# Altium project XilinxZynq7030SOM.PrjPcb (part 1 of 2)
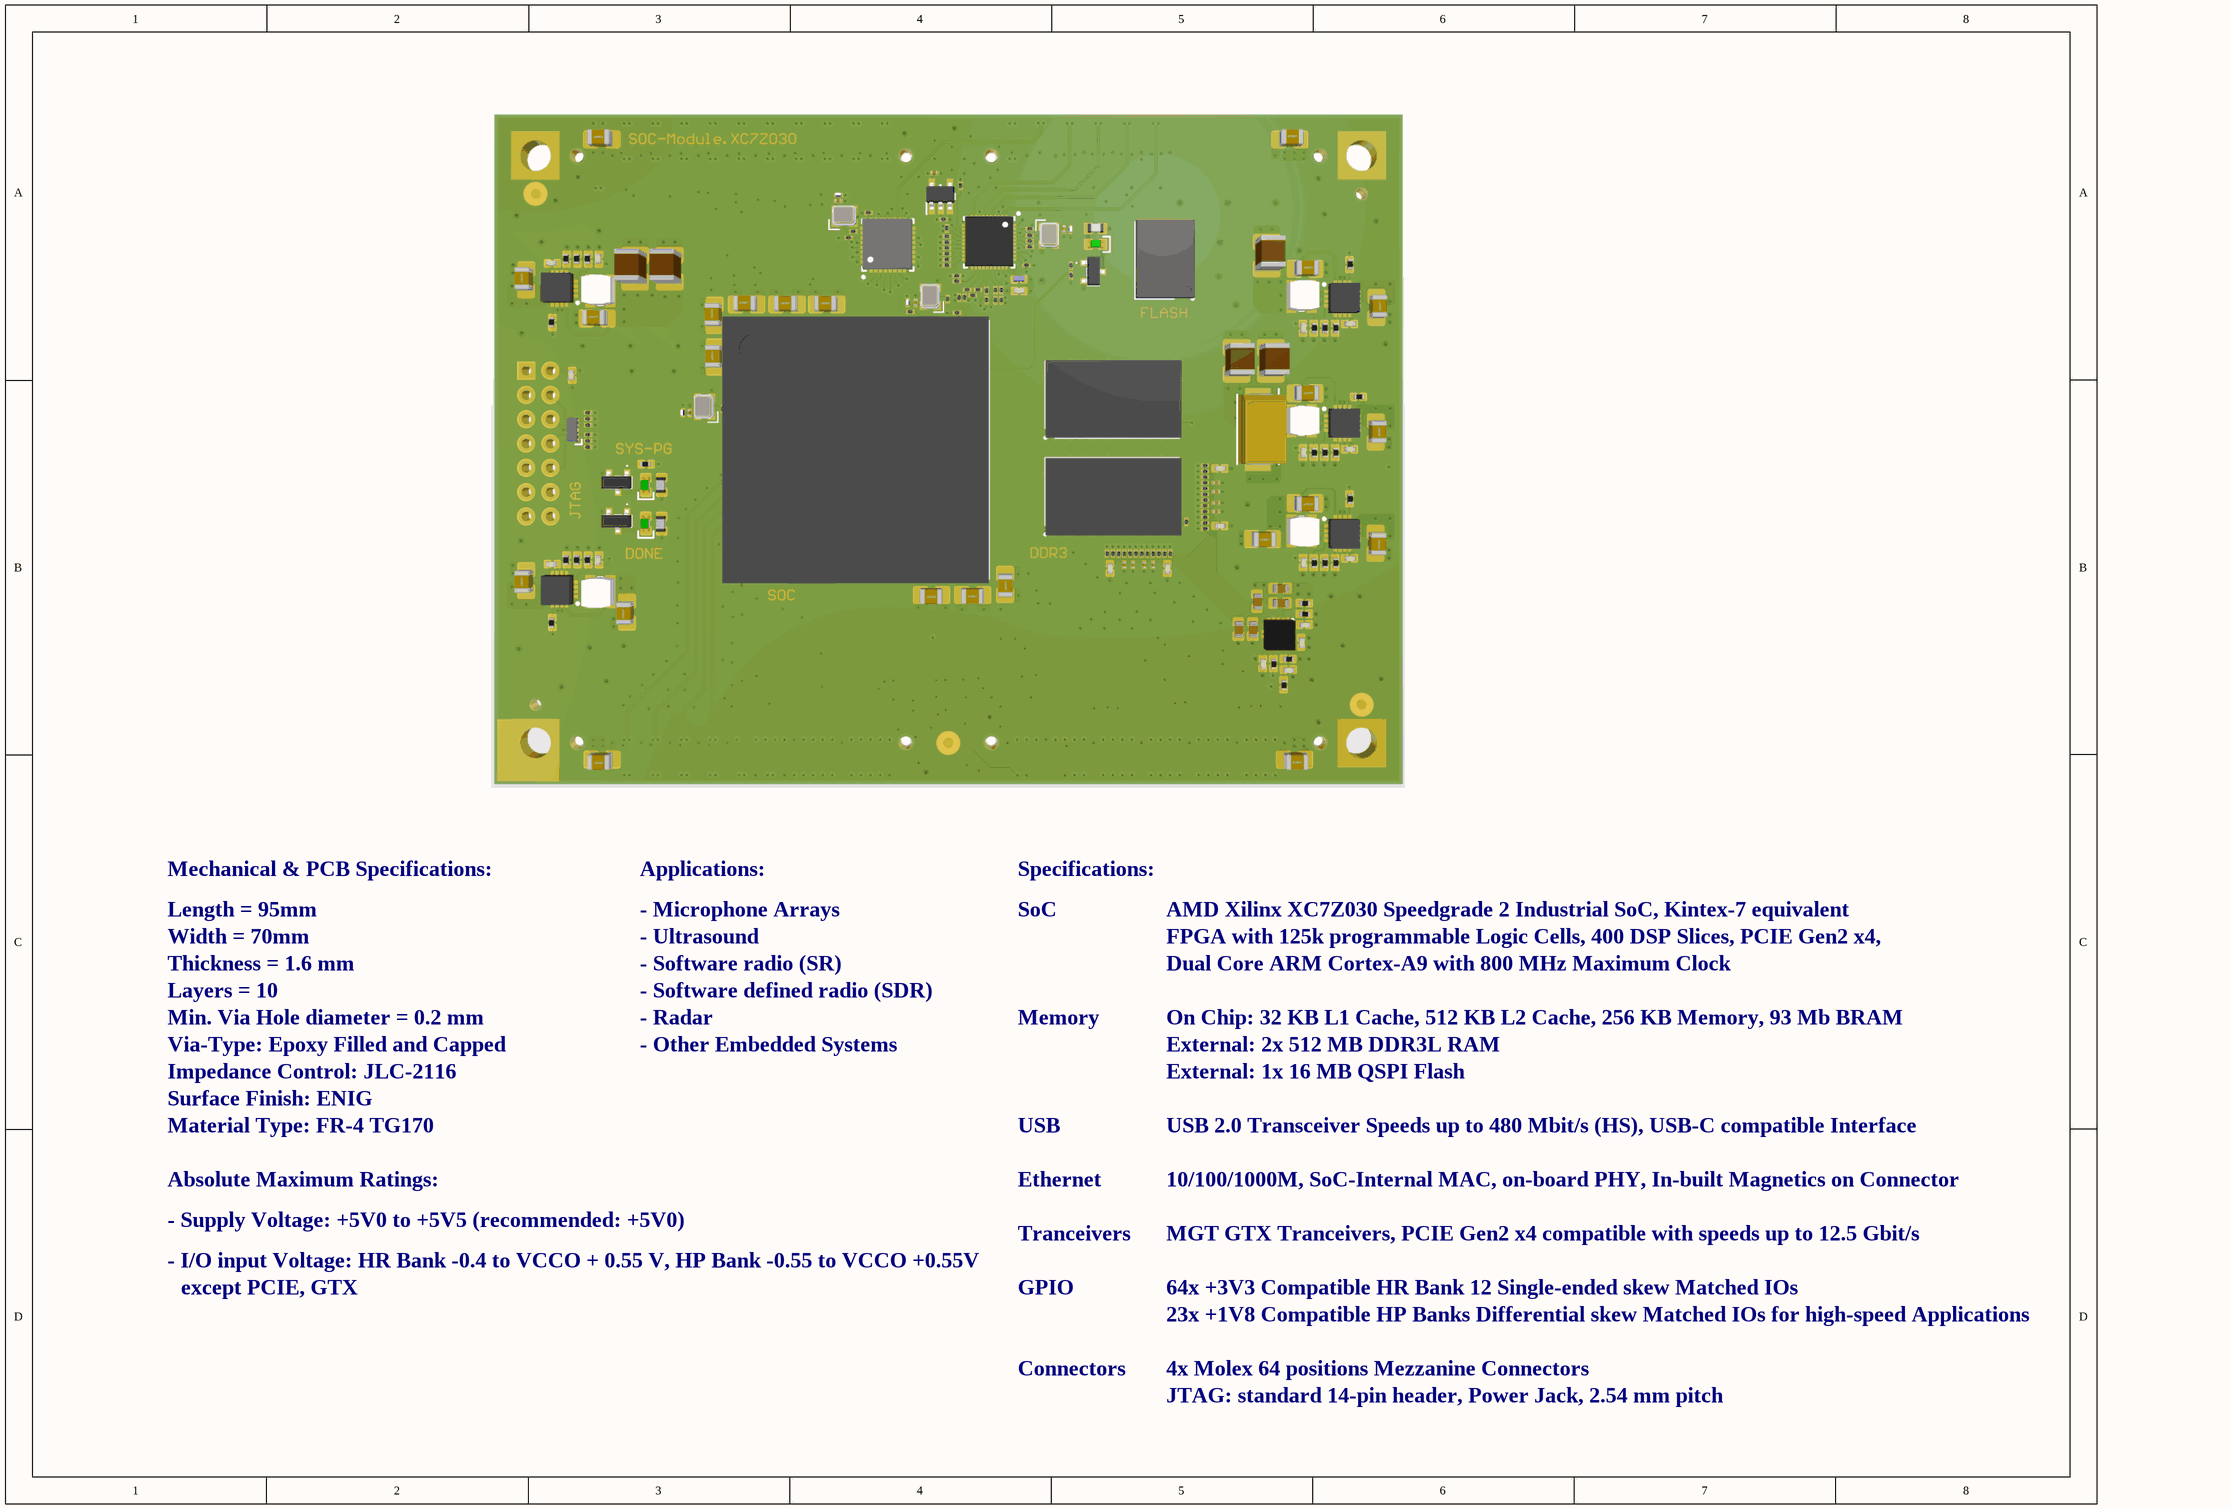
[diagram p0: SOCMainPage.SchDoc]
19 sheets, 290 parts. Net scope: global (net labels, ports and power ports of the same name join across sheets).
Board file: PCBDesign.PcbDoc
Sheets:
  SOCMainPage.SchDoc
  SOMSpecs.SchDoc
  StackupImpedanceControl.SchDoc
  SOCPDN.SchDoc
  SOCPowerSupplys.SchDoc
  SOCPowerDecoupling.SchDoc
  SOCConfiguration.SchDoc
  PLBank12.SchDoc
  PLBank13.SchDoc
  PLBank33.SchDoc
  PLBank34.SchDoc
  PLBank35.SchDoc
  PLMGTBanks.SchDoc
  SOCPSBanks.SchDoc
  SOCDDR3Bank.SchDoc
  DDR3Modules.SchDoc
  SOCEthernetPHY.SchDoc
  SOCUSBHSPHY.SchDoc
  MezzanineConnections.SchDoc

## Sheet SOCMainPage.SchDoc
size A3; SheetNumber: 1; SheetTotal: 19

### Notes on the sheet
- Length = 95mm
- Mechanical & PCB Specifications:
- Applications:
- - Microphone Arrays
- Specifications:
- SoC
- AMD Xilinx XC7Z030 Speedgrade 2 Industrial SoC, Kintex-7 equivalent
- Width = 70mm
- Thickness = 1.6 mm
- - Software radio (SR)
- - Ultrasound
- FPGA with 125k programmable Logic Cells, 400 DSP Slices, PCIE Gen2 x4,
- Dual Core ARM Cortex-A9 with 800 MHz Maximum Clock
- Layers = 10
- Via-Type: Epoxy Filled and Capped
- Min. Via Hole diameter = 0.2 mm
- - Software defined radio (SDR)
- - Radar
- - Other Embedded Systems
- Memory
- On Chip: 32 KB L1 Cache, 512 KB L2 Cache, 256 KB Memory, 93 Mb BRAM
- External: 2x 512 MB DDR3L RAM
- Impedance Control: JLC-2116
- Surface Finish: ENIG
- External: 1x 16 MB QSPI Flash
- Material Type: FR-4 TG170
- Absolute Maximum Ratings:
- USB
- Ethernet
- USB 2.0 Transceiver Speeds up to 480 Mbit/s (HS), USB-C compatible Interface
- 10/100/1000M, SoC-Internal MAC, on-board PHY, In-built Magnetics on Connector
- - Supply Voltage: +5V0 to +5V5 (recommended: +5V0)
- Tranceivers
- MGT GTX Tranceivers, PCIE Gen2 x4 compatible with speeds up to 12.5 Gbit/s
- - I/O input Voltage: HR Bank -0.4 to VCCO + 0.55 V, HP Bank -0.55 to VCCO +0.55V
- except PCIE, GTX
- GPIO
- 64x +3V3 Compatible HR Bank 12 Single-ended skew Matched IOs
- 23x +1V8 Compatible HP Banks Differential skew Matched IOs for high-speed Applications
- Connectors
- 4x Molex 64 positions Mezzanine Connectors
- JTAG: standard 14-pin header, Power Jack, 2.54 mm pitch

## Sheet SOMSpecs.SchDoc
size A4; SheetNumber: 2; SheetTotal: 19
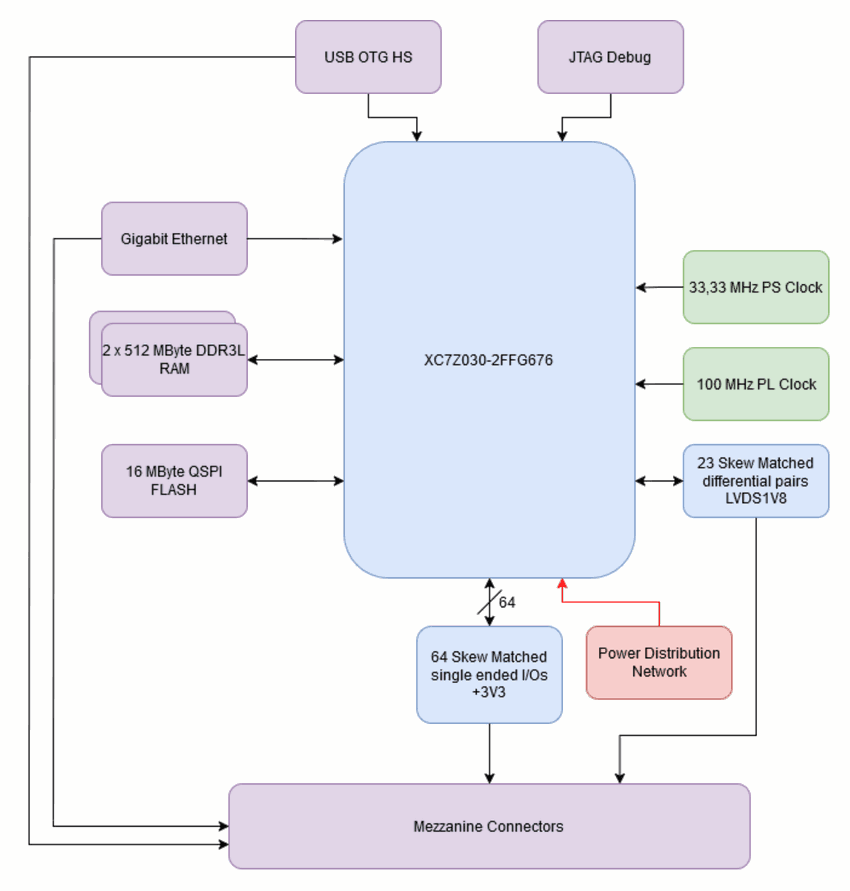
[diagram p1: SOMSpecs.SchDoc]

## Sheet StackupImpedanceControl.SchDoc
size A4; SheetNumber: 3; SheetTotal: 18
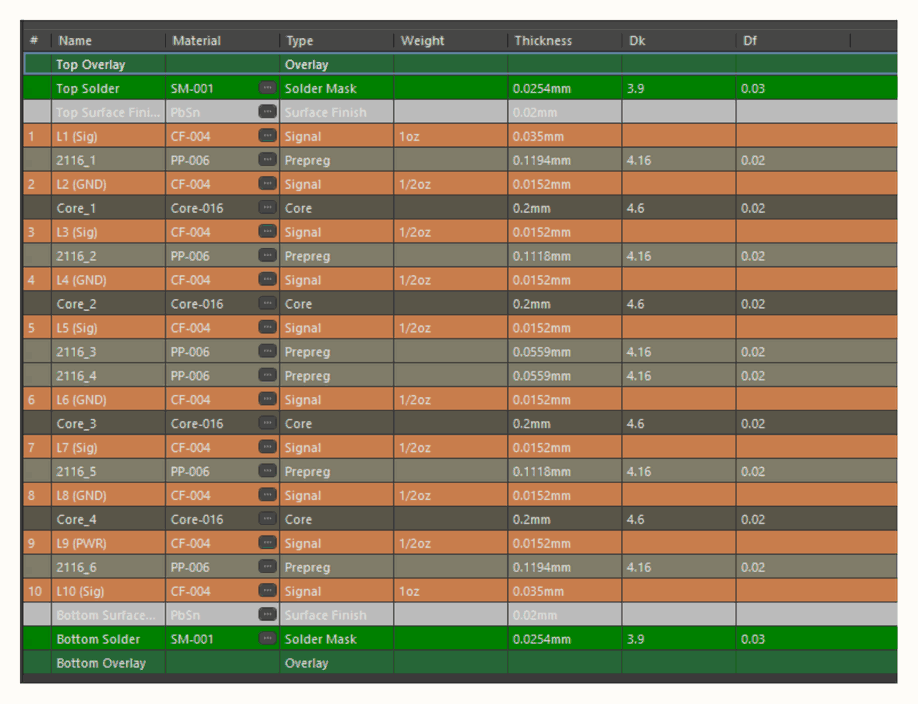
[diagram p2: StackupImpedanceControl.SchDoc]

## Sheet SOCPDN.SchDoc
size A4; SheetNumber: 4; SheetTotal: 18
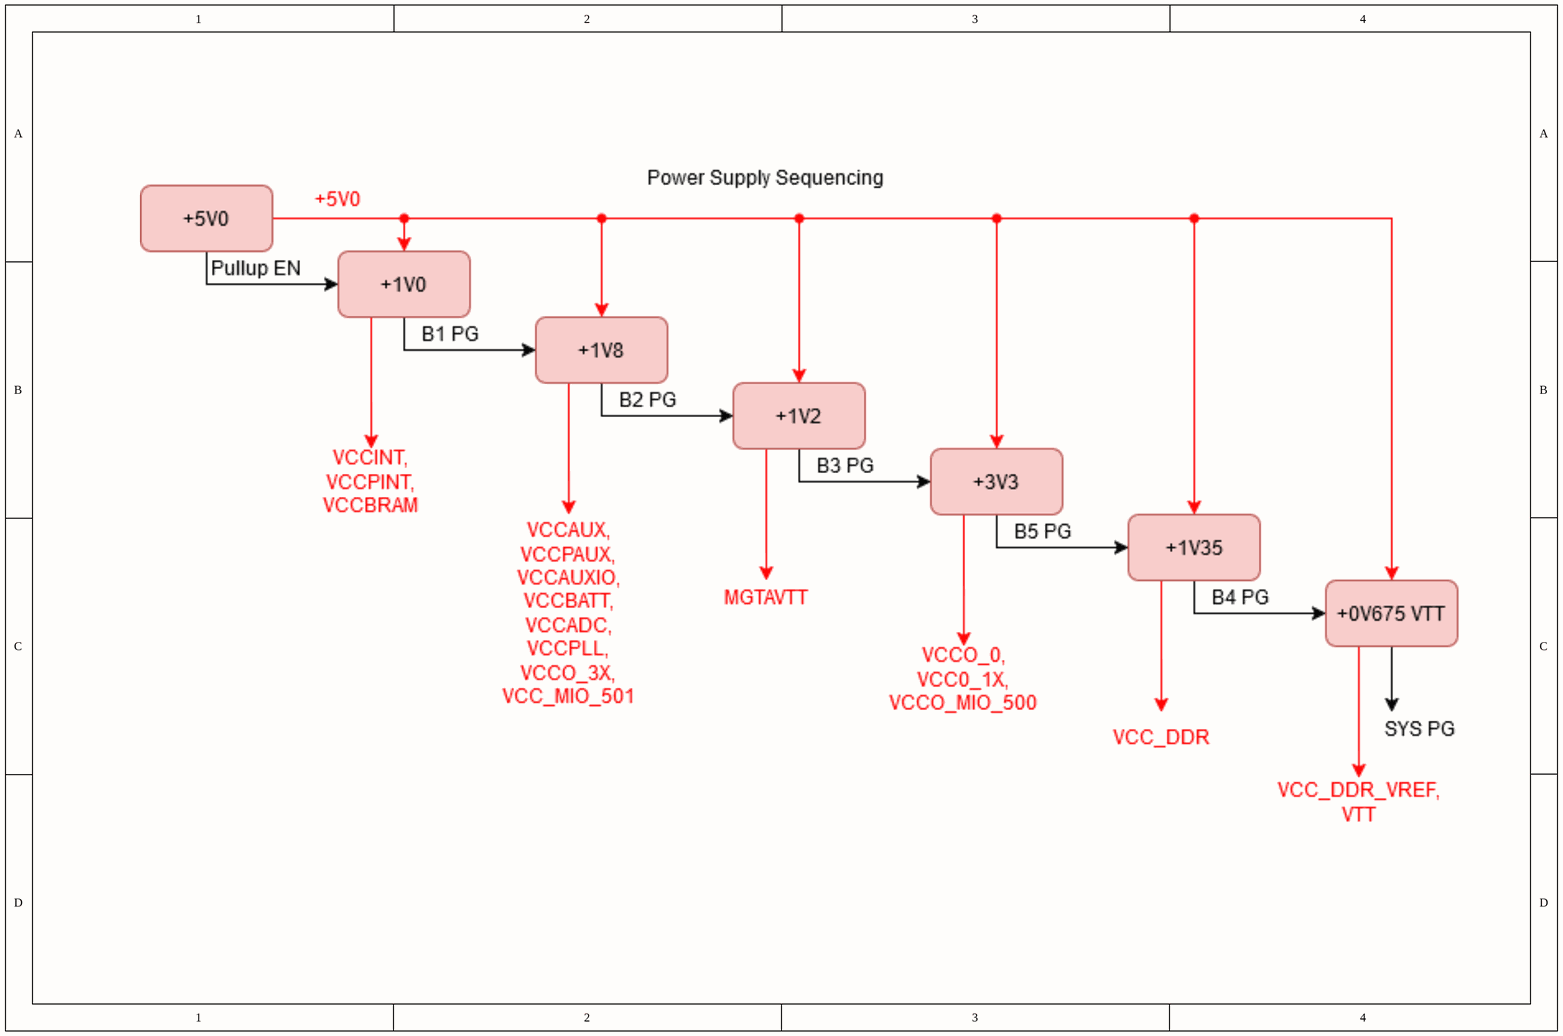
[diagram p3: SOCPDN.SchDoc]

## Sheet SOCPowerSupplys.SchDoc
size A3; SheetNumber: 5; SheetTotal: 18
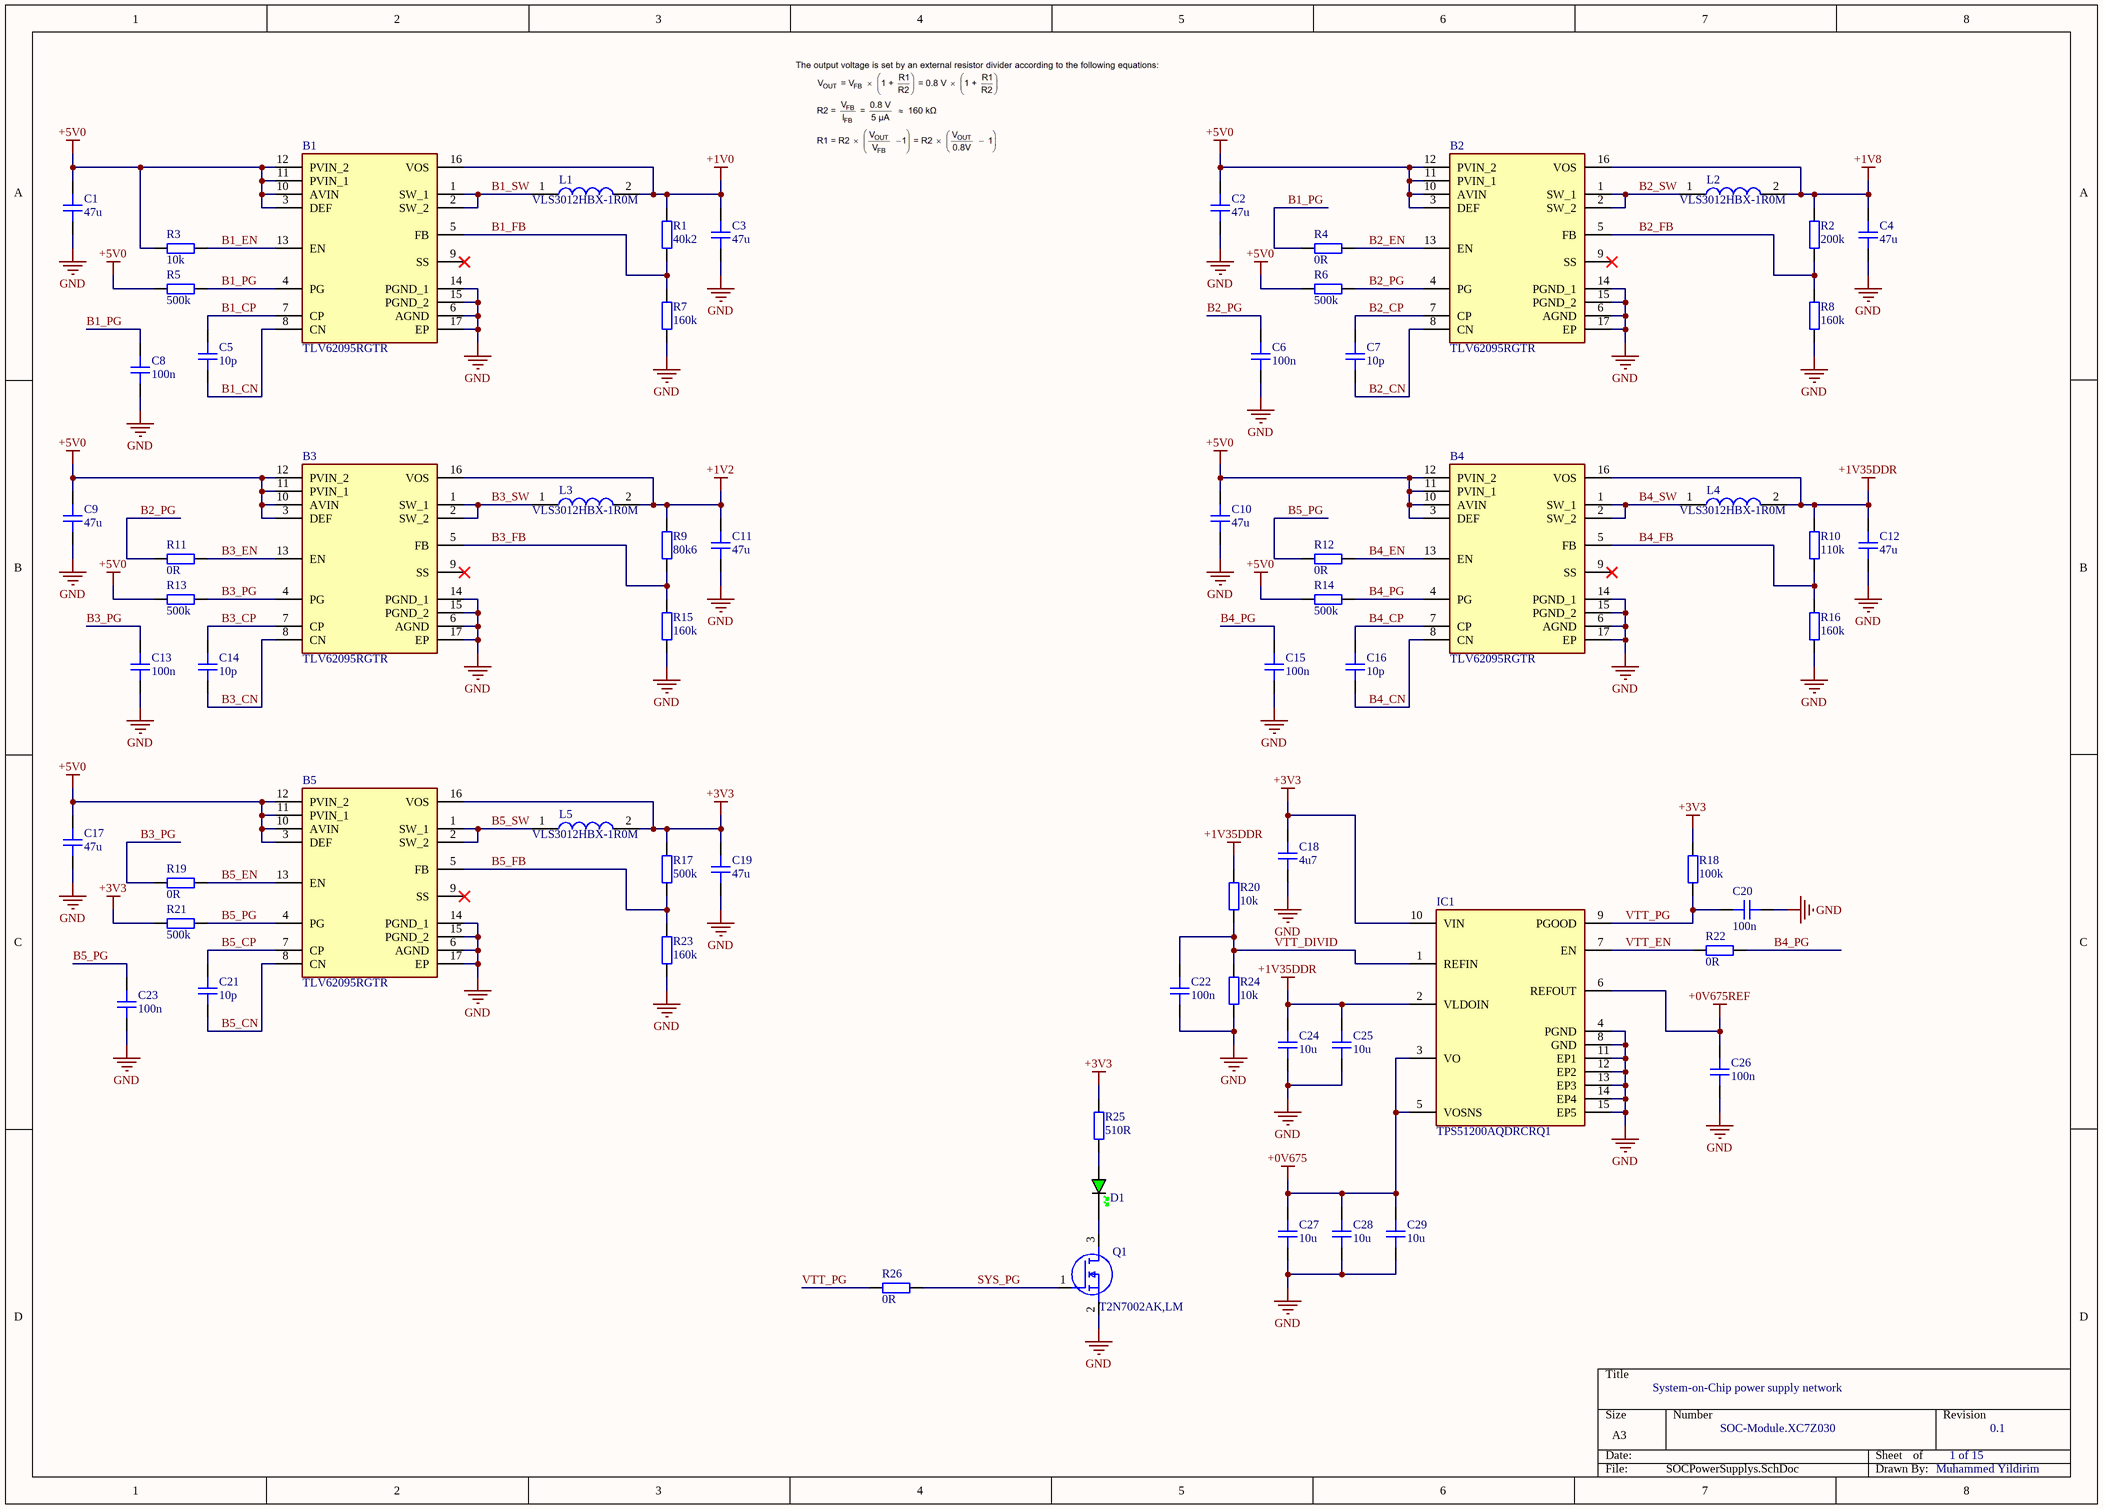
[diagram p4: SOCPowerSupplys.SchDoc]

### Parts
B1  TLV62095RGTR  [QFN50P300X300X100-17N-D]
B2  TLV62095RGTR  [QFN50P300X300X100-17N-D]
B3  TLV62095RGTR  [QFN50P300X300X100-17N-D]
B4  TLV62095RGTR  [QFN50P300X300X100-17N-D]
B5  TLV62095RGTR  [QFN50P300X300X100-17N-D]
C1  47u  [CAP_0805]
C2  47u  [CAP_0805]
C3  47u  [CAP_0805]
C4  47u  [CAP_0805]
C5  10p  [CAP_0402]
C6  100n  [CAP_0402]
C7  10p  [CAP_0402]
C8  100n  [CAP_0402]
C9  47u  [CAP_0805]
C10  47u  [CAP_0805]
C11  47u  [CAP_0805]
C12  47u  [CAP_0805]
C13  100n  [CAP_0402]
C14  10p  [CAP_0402]
C15  100n  [CAP_0402]
C16  10p  [CAP_0402]
C17  47u  [CAP_0805]
C18  4u7  [CAP_0402]
C19  47u  [CAP_0805]
C20  100n  [CAP_0402]
C21  10p  [CAP_0402]
C22  100n  [CAP_0402]
C23  100n  [CAP_0402]
C24  10u  [CAP_0603]
C25  10u  [CAP_0603]
C26  100n  [CAP_0402]
C27  10u  [CAP_0603]
C28  10u  [CAP_0603]
C29  10u  [CAP_0603]
D1  GREEN  [LED_0603_GREEN]  (value not drawn)
IC1  TPS51200AQDRCRQ1  [TPS51200AQDRCRQ1]
L1  VLS3012HBX-1R0M  [VLS3012]
L2  VLS3012HBX-1R0M  [VLS3012]
L3  VLS3012HBX-1R0M  [VLS3012]
L4  VLS3012HBX-1R0M  [VLS3012]
L5  VLS3012HBX-1R0M  [VLS3012]
Q1  T2N7002AK,LM  [TBAT54CLM]
R1  40k2  [RES_0402]
R2  200k  [RES_0402]
R3  10k  [RES_0402]
R4  0R  [RES_0402]
R5  500k  [RES_0402]
R6  500k  [RES_0402]
R7  160k  [RES_0402]
R8  160k  [RES_0402]
R9  80k6  [RES_0402]
R10  110k  [RES_0402]
R11  0R  [RES_0402]
R12  0R  [RES_0402]
R13  500k  [RES_0402]
R14  500k  [RES_0402]
R15  160k  [RES_0402]
R16  160k  [RES_0402]
R17  500k  [RES_0402]
R18  100k  [RES_0402]
R19  0R  [RES_0402]
R20  10k  [RES_0402]
R21  500k  [RES_0402]
R22  0R  [RES_0402]
R23  160k  [RES_0402]
R24  10k  [RES_0402]
R25  510R  [RES_0603]
R26  0R  [RES_0402]

### Nets
+0V675: C27.2 C28.2 C29.2 IC1.3(VO) IC1.5(VOSNS)
+0V675REF: C26.2 IC1.6(REFOUT)
+1V0: B1.16(VOS) C3.2 L1.2 R1.2
+1V2: B3.16(VOS) C11.2 L3.2 R9.2
+1V8: B2.16(VOS) C4.2 L2.2 R2.2
+1V35DDR: B4.16(VOS) C12.2 C24.2 C25.2 IC1.2(VLDOIN) L4.2 R10.2 R20.2
+3V3: B5.16(VOS) C18.2 C19.2 IC1.10(VIN) L5.2 R17.2 R18.2 R21.1 R25.2
+5V0: B1.3(DEF) B1.10(AVIN) B1.11(PVIN_1) B1.12(PVIN_2) B2.3(DEF) B2.10(AVIN) B2.11(PVIN_1) B2.12(PVIN_2) B3.3(DEF) B3.10(AVIN) B3.11(PVIN_1) B3.12(PVIN_2) B4.3(DEF) B4.10(AVIN) B4.11(PVIN_1) B4.12(PVIN_2) B5.3(DEF) B5.10(AVIN) B5.11(PVIN_1) B5.12(PVIN_2) C1.2 C2.2 C9.2 C10.2 C17.2 R3.1 R5.1 R6.1 R13.1 R14.1
GND: B1.6(AGND) B1.14(PGND_1) B1.15(PGND_2) B1.17(EP) B2.6(AGND) B2.14(PGND_1) B2.15(PGND_2) B2.17(EP) B3.6(AGND) B3.14(PGND_1) B3.15(PGND_2) B3.17(EP) B4.6(AGND) B4.14(PGND_1) B4.15(PGND_2) B4.17(EP) B5.6(AGND) B5.14(PGND_1) B5.15(PGND_2) B5.17(EP) C1.1 C2.1 C3.1 C4.1 C6.1 C8.1 C9.1 C10.1 C11.1 C12.1 C13.1 C15.1 C17.1 C18.1 C19.1 C20.1 C22.1 C23.1 C24.1 C25.1 C26.1 C27.1 C28.1 C29.1 IC1.4(PGND) IC1.8(GND) IC1.11(EP1) IC1.12(EP2) IC1.13(EP3) IC1.14(EP4) IC1.15(EP5) Q1.2(S) R7.1 R8.1 R15.1 R16.1 R23.1 R24.1
B1_CN: B1.8(CN) C5.1
B1_CP: B1.7(CP) C5.2
B1_EN: B1.13(EN) R3.2
B1_FB: B1.5(FB) R1.1 R7.2
B1_PG: B1.4(PG) C8.2 R4.2 R5.2
B1_SW: B1.1(SW_1) B1.2(SW_2) L1.1
B2_CN: B2.8(CN) C7.1
B2_CP: B2.7(CP) C7.2
B2_EN: B2.13(EN) R4.1
B2_FB: B2.5(FB) R2.1 R8.2
B2_PG: B2.4(PG) C6.2 R6.2 R11.2
B2_SW: B2.1(SW_1) B2.2(SW_2) L2.1
B3_CN: B3.8(CN) C14.1
B3_CP: B3.7(CP) C14.2
B3_EN: B3.13(EN) R11.1
B3_FB: B3.5(FB) R9.1 R15.2
B3_PG: B3.4(PG) C13.2 R13.2 R19.2
B3_SW: B3.1(SW_1) B3.2(SW_2) L3.1
B4_CN: B4.8(CN) C16.1
B4_CP: B4.7(CP) C16.2
B4_EN: B4.13(EN) R12.1
B4_FB: B4.5(FB) R10.1 R16.2
B4_PG: B4.4(PG) C15.2 R14.2 R22.1
B4_SW: B4.1(SW_1) B4.2(SW_2) L4.1
B5_CN: B5.8(CN) C21.1
B5_CP: B5.7(CP) C21.2
B5_EN: B5.13(EN) R19.1
B5_FB: B5.5(FB) R17.1 R23.2
B5_PG: B5.4(PG) C23.2 R12.2 R21.2
B5_SW: B5.1(SW_1) B5.2(SW_2) L5.1
SYS_PG: Q1.1(G) R26.1
VTT_DIVID: C22.2 IC1.1(REFIN) R20.1 R24.2
VTT_EN: IC1.7(EN) R22.2
VTT_PG: C20.2 IC1.9(PGOOD) R18.1 R26.2
NetD1_A: D1.A R25.1
NetD1_K: D1.K Q1.3(D)

Not connected (* = marked no-connect by the designer): B1 9(SS)*; B2 9(SS)*; B3 9(SS)*; B4 9(SS)*; B5 9(SS)*

### Notes on the sheet
- System-on-Chip power supply network
- SOC-Module.XC7Z030
- 1 of 15
- 0.1
- Muhammed Yildirim

### Library data of the parts
B1-B5 = TLV62095RGTR: 4A Synchronous Step Down Converter with DCS Control; Manufacturer_Name: Texas Instruments; Geometry.Height: 1mm; Mouser Part Number: 595-TLV62095RGTR; Mouser Price/Stock: https://www.mouser.co.uk/ProductDetail/Texas-Instruments/TLV62095RGTR?qs=f4l5qYp%2Fy%252B5FMQoaGbkQ%252Bg%3D%3D; Manufacturer_Part_Number: TLV62095RGTR; Datasheet Link: http://www.ti.com/lit/gpn/TLV62095
C1-C4 C9-C12 C17 C19 = CAP_0805: Capacitor SMD 0805; Manufacturer: *; Manufacturer Part Number: *; Distributor Link: *; LCSC: *; Rating: *; Dielectric: *
C5-C8 C13-C16 C18 C20-C23 C26 = CAP_0402: Capacitor SMD 0402; Manufacturer: *; Manufacturer Part Number: *; Distributor Link: *; LCSC: *; Rating: *; Dielectric: *
C24 C25 C27-C29 = CAP_0603: Capacitor SMD 0603; Manufacturer: *; Manufacturer Part Number: *; Distributor Link: *; LCSC: *; Rating: *; Dielectric: *
D1 = LED_0603_GREEN: LED 0603 GREEN SMD
IC1 = TPS51200AQDRCRQ1: Texas Instruments Sink and Source DDR Termination Regulator
L1-L5 = VLS3012HBX-1R0M: Inductor; Manufacturer_Name: TDK; Datasheet Link: https://product.tdk.com/system/files/dam/doc/product/inductor/inductor/smd/catalog/inductor_commercial_power_vls3012hbx_en.pdf; Manufacturer_Part_Number: VLS3012HBX-1R0M; Mouser Part Number: 810-VLS3012HBX-1R0M; Mouser Price/Stock: https://www.mouser.co.uk/ProductDetail/TDK/VLS3012HBX-1R0M?qs=pfd5qewlna4O71VRfcrI8g%3D%3D; Arrow Part Number: VLS3012HBX-1R0M; Arrow Price/Stock: https://www.arrow.com/en/products/vls3012hbx-1r0m/tdk?region=nac
Q1 = T2N7002AK,LM: MOSFET (N-Channel); Manufacturer_Name: Toshiba; Datasheet Link: http://toshiba.semicon-storage.com/info/docget.jsp?did=29712&prodName=T2N7002AK; Height: 1.1mm; Manufacturer_Part_Number: T2N7002AK,LM; Mouser Part Number: 757-T2N7002AKLM; Mouser Price/Stock: https://www.mouser.co.uk/ProductDetail/Toshiba/T2N7002AKLM?qs=pzVvXTvk9PzfX4hYglwZ9Q%3D%3D; Arrow Part Number: T2N7002AK,LM; Arrow Price/Stock: https://www.arrow.com/en/products/t2n7002aklm/toshiba?region=nac
R1-R24 R26 = RES_0402: Resistor SMD 0402; Manufacturer: *; Manufacturer Part Number: *; Distributor Link: *; LCSC: *
R25 = RES_0603: Resistor SMD 0603; Manufacturer: *; Manufacturer Part Number: *; Distributor Link: *; LCSC: *

## Sheet SOCPowerDecoupling.SchDoc
size A3; SheetNumber: 6; SheetTotal: 18
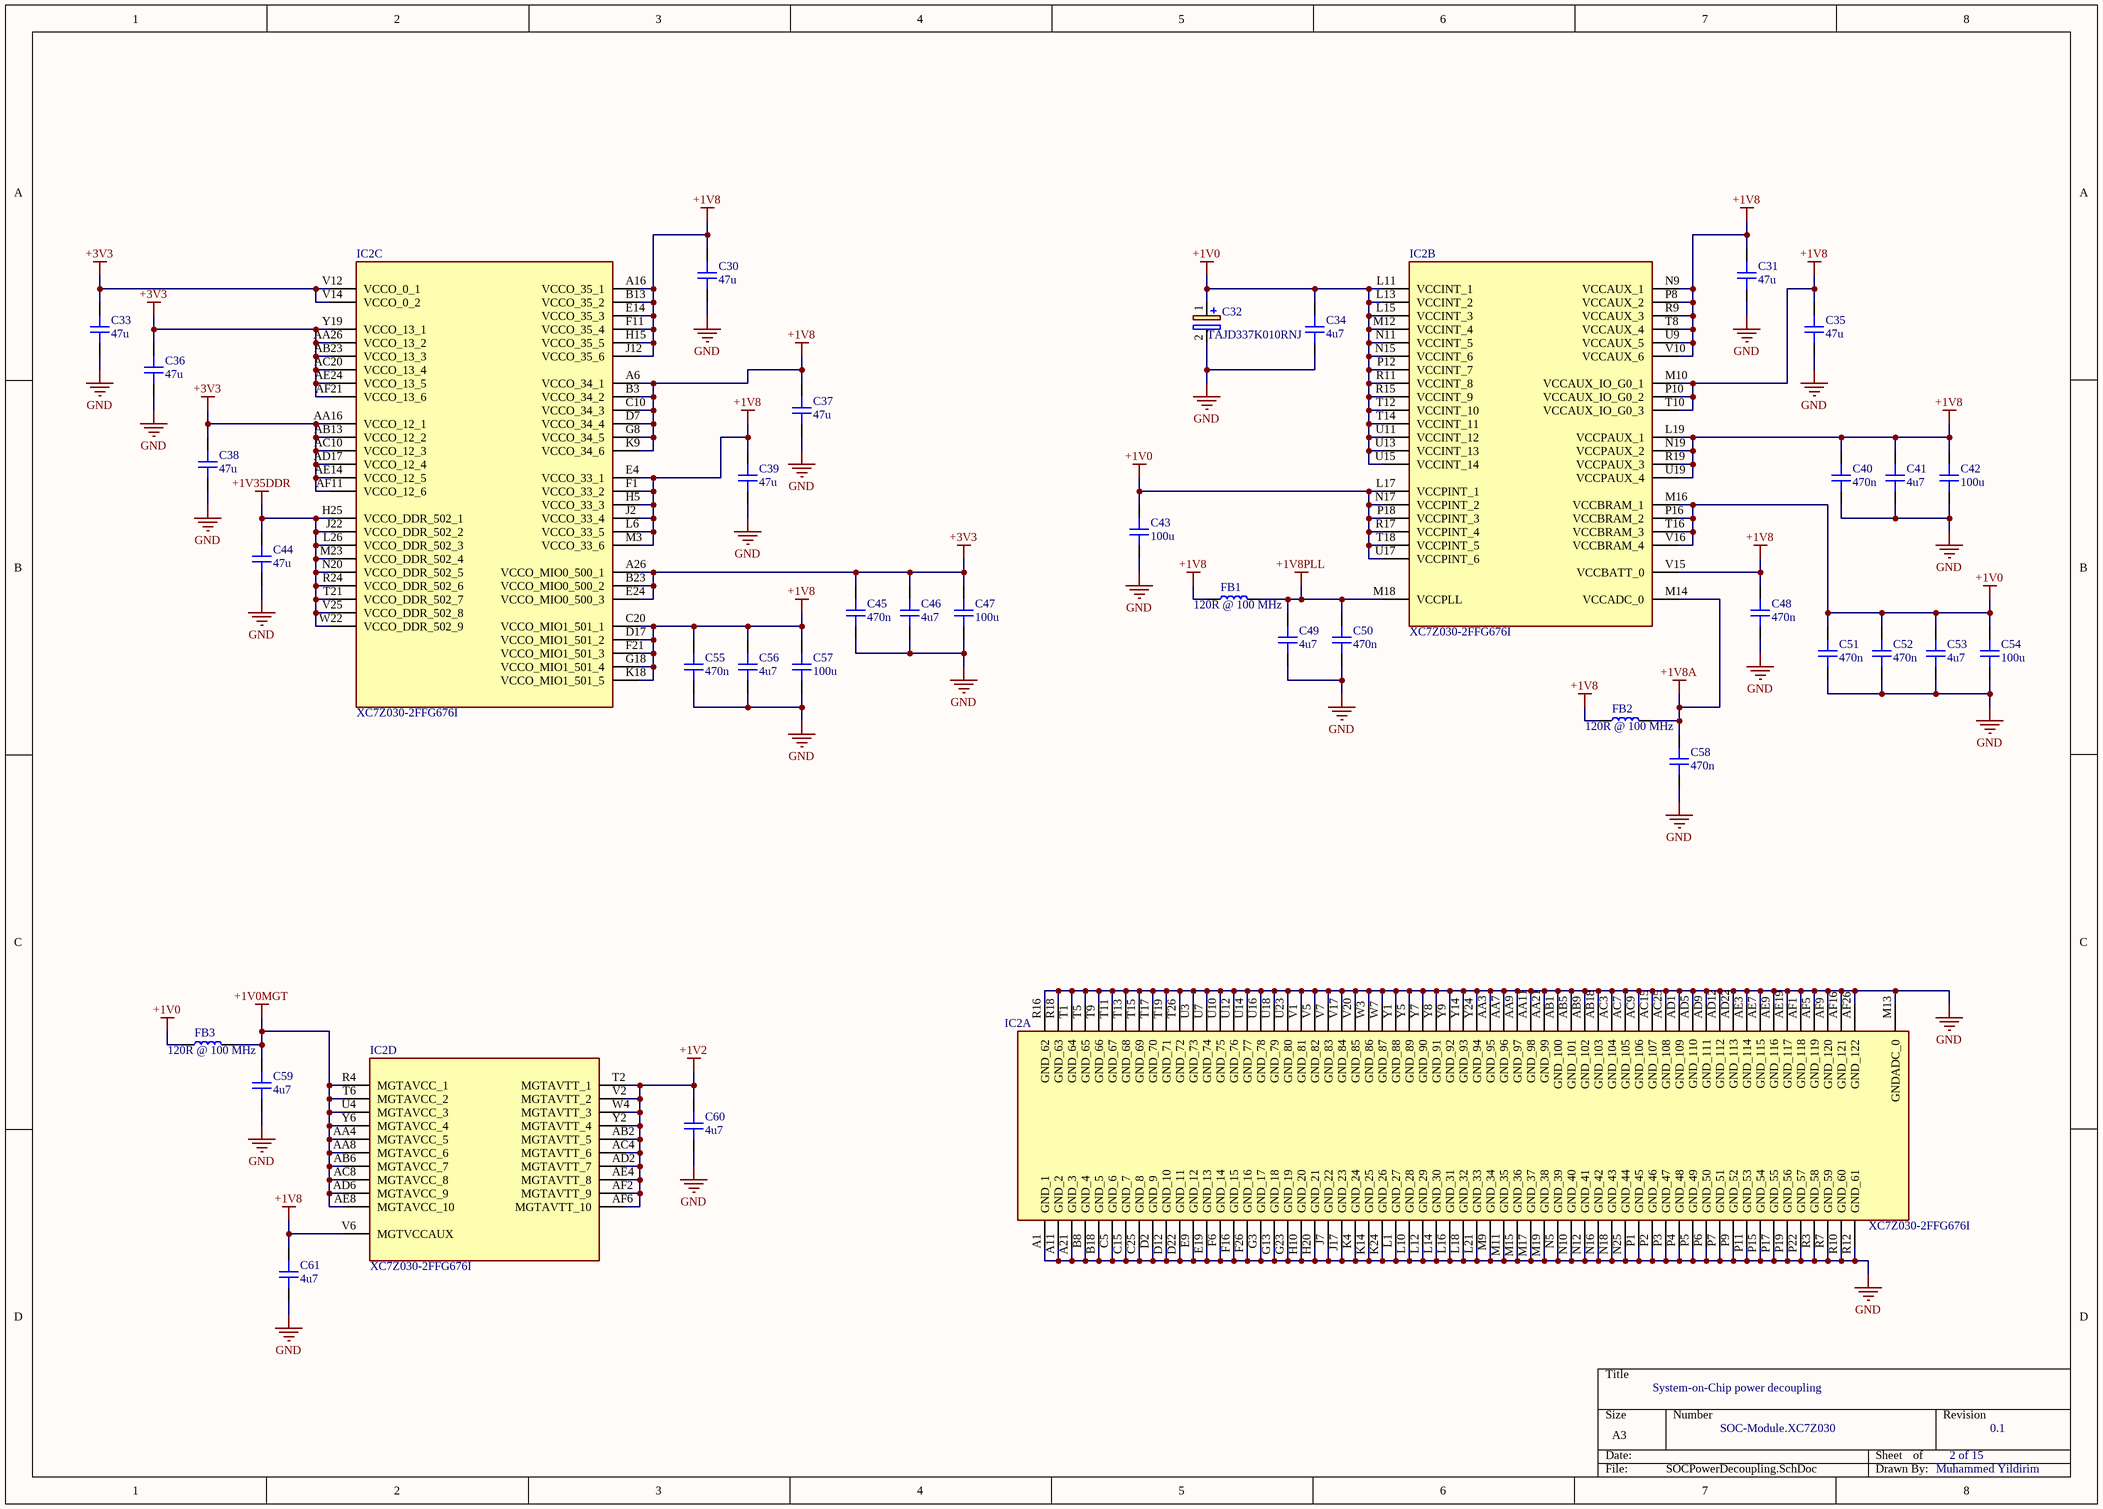
[diagram p5: SOCPowerDecoupling.SchDoc]

### Parts
C30  47u  [CAP_0805]
C31  47u  [CAP_0805]
C32  TAJD337K010RNJ  [CAPPM7344X310N]
C33  47u  [CAP_0805]
C34  4u7  [CAP_0402]
C35  47u  [CAP_0805]
C36  47u  [CAP_0805]
C37  47u  [CAP_0805]
C38  47u  [CAP_0805]
C39  47u  [CAP_0805]
C40  470n  [CAP_0201]
C41  4u7  [CAP_0402]
C42  100u  [CAP_1210]
C43  100u  [CAP_1210]
C44  47u  [CAP_0805]
C45  470n  [CAP_0201]
C46  4u7  [CAP_0402]
C47  100u  [CAP_1210]
C48  470n  [CAP_0201]
C49  4u7  [CAP_0402]
C50  470n  [CAP_0201]
C51  470n  [CAP_0201]
C52  470n  [CAP_0201]
C53  4u7  [CAP_0402]
C54  100u  [CAP_1210]
C55  470n  [CAP_0201]
C56  4u7  [CAP_0402]
C57  100u  [CAP_1210]
C58  470n  [CAP_0201]
C59  4u7  [CAP_0402]
C60  4u7  [CAP_0402]
C61  4u7  [CAP_0402]
FB1  120R @ 100 MHz  [IND_0201]
FB2  120R @ 100 MHz  [IND_0201]
FB3  120R @ 100 MHz  [IND_0201]
IC2  XC7Z030-2FFG676I  [BGA676C100P26X26_2700X2700X324]  (parts A,B,C,D of 15)

### Nets
+1V0: C32.1(+) C34.2 C43.2 C51.2 C52.2 C53.2 C54.2 FB3.1 IC2.L11(VCCINT_1) IC2.L13(VCCINT_2) IC2.L15(VCCINT_3) IC2.L17(VCCPINT_1) IC2.M12(VCCINT_4) IC2.M16(VCCBRAM_1) IC2.N11(VCCINT_5) IC2.N15(VCCINT_6) IC2.N17(VCCPINT_2) IC2.P12(VCCINT_7) IC2.P16(VCCBRAM_2) IC2.P18(VCCPINT_3) IC2.R11(VCCINT_8) IC2.R15(VCCINT_9) IC2.R17(VCCPINT_4) IC2.T12(VCCINT_10) IC2.T14(VCCINT_11) IC2.T16(VCCBRAM_3) IC2.T18(VCCPINT_5) IC2.U11(VCCINT_12) IC2.U13(VCCINT_13) IC2.U15(VCCINT_14) IC2.U17(VCCPINT_6) IC2.V16(VCCBRAM_4)
+1V0MGT: C59.2 FB3.2 IC2.AA4(MGTAVCC_5) IC2.AA8(MGTAVCC_6) IC2.AB6(MGTAVCC_7) IC2.AC8(MGTAVCC_8) IC2.AD6(MGTAVCC_9) IC2.AE8(MGTAVCC_10) IC2.R4(MGTAVCC_1) IC2.T6(MGTAVCC_2) IC2.U4(MGTAVCC_3) IC2.Y6(MGTAVCC_4)
+1V2: C60.2 IC2.AB2(MGTAVTT_5) IC2.AC4(MGTAVTT_6) IC2.AD2(MGTAVTT_7) IC2.AE4(MGTAVTT_8) IC2.AF2(MGTAVTT_9) IC2.AF6(MGTAVTT_10) IC2.T2(MGTAVTT_1) IC2.V2(MGTAVTT_2) IC2.W4(MGTAVTT_3) IC2.Y2(MGTAVTT_4)
+1V8: C30.2 C31.2 C35.2 C37.2 C39.2 C40.2 C41.2 C42.2 C48.2 C55.2 C56.2 C57.2 C61.2 FB1.1 FB2.1 IC2.A6(VCCO_34_1) IC2.A16(VCCO_35_1) IC2.B3(VCCO_34_2) IC2.B13(VCCO_35_2) IC2.C10(VCCO_34_3) IC2.C20(VCCO_MIO1_501_1) IC2.D7(VCCO_34_4) IC2.D17(VCCO_MIO1_501_2) IC2.E4(VCCO_33_1) IC2.E14(VCCO_35_3) IC2.F1(VCCO_33_2) IC2.F11(VCCO_35_4) IC2.F21(VCCO_MIO1_501_3) IC2.G8(VCCO_34_5) IC2.G18(VCCO_MIO1_501_4) IC2.H5(VCCO_33_3) IC2.H15(VCCO_35_5) IC2.J2(VCCO_33_4) IC2.J12(VCCO_35_6) IC2.K9(VCCO_34_6) IC2.K18(VCCO_MIO1_501_5) IC2.L6(VCCO_33_5) IC2.L19(VCCPAUX_1) IC2.M3(VCCO_33_6) IC2.M10(VCCAUX_IO_G0_1) IC2.N9(VCCAUX_1) IC2.N19(VCCPAUX_2) IC2.P8(VCCAUX_2) IC2.P10(VCCAUX_IO_G0_2) IC2.R9(VCCAUX_3) IC2.R19(VCCPAUX_3) IC2.T8(VCCAUX_4) IC2.T10(VCCAUX_IO_G0_3) IC2.U9(VCCAUX_5) IC2.U19(VCCPAUX_4) IC2.V6(MGTVCCAUX) IC2.V10(VCCAUX_6) IC2.V15(VCCBATT_0)
+1V8A: C58.2 FB2.2 IC2.M14(VCCADC_0)
+1V8PLL: C49.2 C50.2 FB1.2 IC2.M18(VCCPLL)
+1V35DDR: C44.2 IC2.H25(VCCO_DDR_502_1) IC2.J22(VCCO_DDR_502_2) IC2.L26(VCCO_DDR_502_3) IC2.M23(VCCO_DDR_502_4) IC2.N20(VCCO_DDR_502_5) IC2.R24(VCCO_DDR_502_6) IC2.T21(VCCO_DDR_502_7) IC2.V25(VCCO_DDR_502_8) IC2.W22(VCCO_DDR_502_9)
+3V3: C33.2 C36.2 C38.2 C45.2 C46.2 C47.2 IC2.A26(VCCO_MIO0_500_1) IC2.AA16(VCCO_12_1) IC2.AA26(VCCO_13_2) IC2.AB13(VCCO_12_2) IC2.AB23(VCCO_13_3) IC2.AC10(VCCO_12_3) IC2.AC20(VCCO_13_4) IC2.AD17(VCCO_12_4) IC2.AE14(VCCO_12_5) IC2.AE24(VCCO_13_5) IC2.AF11(VCCO_12_6) IC2.AF21(VCCO_13_6) IC2.B23(VCCO_MIO0_500_2) IC2.E24(VCCO_MIO0_500_3) IC2.V12(VCCO_0_1) IC2.V14(VCCO_0_2) IC2.Y19(VCCO_13_1)
GND: C30.1 C31.1 C32.2(-) C33.1 C34.1 C35.1 C36.1 C37.1 C38.1 C39.1 C40.1 C41.1 C42.1 C43.1 C44.1 C45.1 C46.1 C47.1 C48.1 C49.1 C50.1 C51.1 C52.1 C53.1 C54.1 C55.1 C56.1 C57.1 C58.1 C59.1 C60.1 C61.1 IC2.A1(GND_1) IC2.A11(GND_2) IC2.A21(GND_3) IC2.AA3(GND_95) IC2.AA7(GND_96) IC2.AA9(GND_97) IC2.AA11(GND_98) IC2.AA21(GND_99) IC2.AB1(GND_100) IC2.AB5(GND_101) IC2.AB9(GND_102) IC2.AB18(GND_103) IC2.AC3(GND_104) IC2.AC7(GND_105) IC2.AC9(GND_106) IC2.AC15(GND_107) IC2.AC25(GND_108) IC2.AD1(GND_109) IC2.AD5(GND_110) IC2.AD9(GND_111) IC2.AD12(GND_112) IC2.AD22(GND_113) IC2.AE3(GND_114) IC2.AE7(GND_115) IC2.AE9(GND_116) IC2.AE19(GND_117) IC2.AF1(GND_118) IC2.AF5(GND_119) IC2.AF9(GND_120) IC2.AF16(GND_121) IC2.AF26(GND_122) IC2.B8(GND_4) IC2.B18(GND_5) IC2.C5(GND_6) IC2.C15(GND_7) IC2.C25(GND_8) IC2.D2(GND_9) IC2.D12(GND_10) IC2.D22(GND_11) IC2.E9(GND_12) IC2.E19(GND_13) IC2.F6(GND_14) IC2.F16(GND_15) IC2.F26(GND_16) IC2.G3(GND_17) IC2.G13(GND_18) IC2.G23(GND_19) IC2.H10(GND_20) IC2.H20(GND_21) IC2.J7(GND_22) IC2.J17(GND_23) IC2.K4(GND_24) IC2.K14(GND_25) IC2.K24(GND_26) IC2.L1(GND_27) IC2.L10(GND_28) IC2.L12(GND_29) IC2.L14(GND_30) IC2.L16(GND_31) IC2.L18(GND_32) IC2.L21(GND_33) IC2.M9(GND_34) IC2.M11(GND_35) IC2.M13(GNDADC_0) IC2.M15(GND_36) IC2.M17(GND_37) IC2.M19(GND_38) IC2.N5(GND_39) IC2.N10(GND_40) IC2.N12(GND_41) IC2.N16(GND_42) IC2.N18(GND_43) IC2.N25(GND_44) IC2.P1(GND_45) IC2.P2(GND_46) IC2.P3(GND_47) IC2.P4(GND_48) IC2.P5(GND_49) IC2.P6(GND_50) IC2.P7(GND_51) IC2.P9(GND_52) IC2.P11(GND_53) IC2.P15(GND_54) IC2.P17(GND_55) IC2.P19(GND_56) IC2.P22(GND_57) IC2.R3(GND_58) IC2.R7(GND_59) IC2.R10(GND_60) IC2.R12(GND_61) IC2.R16(GND_62) IC2.R18(GND_63) IC2.T1(GND_64) IC2.T5(GND_65) IC2.T9(GND_66) IC2.T11(GND_67) IC2.T13(GND_68) IC2.T15(GND_69) IC2.T17(GND_70) IC2.T19(GND_71) IC2.T26(GND_72) IC2.U3(GND_73) IC2.U7(GND_74) IC2.U10(GND_75) IC2.U12(GND_76) IC2.U14(GND_77) IC2.U16(GND_78) IC2.U18(GND_79) IC2.U23(GND_80) IC2.V1(GND_81) IC2.V5(GND_82) IC2.V7(GND_83) IC2.V17(GND_84) IC2.V20(GND_85) IC2.W3(GND_86) IC2.W7(GND_87) IC2.Y1(GND_88) IC2.Y5(GND_89) IC2.Y7(GND_90) IC2.Y8(GND_91) IC2.Y9(GND_92) IC2.Y14(GND_93) IC2.Y24(GND_94)

### Notes on the sheet
- System-on-Chip power decoupling
- SOC-Module.XC7Z030
- 2 of 15
- 0.1
- Muhammed Yildirim

### Library data of the parts
C30 C31 C33 C35-C39 C44 = CAP_0805: Capacitor SMD 0805; Manufacturer: *; Manufacturer Part Number: *; Distributor Link: *; LCSC: *; Rating: *; Dielectric: *
C32 = TAJD337K010RNJ: 330 uF Tantalum Capacitor; Manufacturer_Name: KEMET; Manufacturer_Part_Number: T491A106M010AT; Datasheet Link: https://content.kemet.com/datasheets/KEM_T2005_T491.pdf; Height: 1.8mm; Mouser Part Number: 80-T491A106M010; Mouser Price/Stock: https://www.mouser.co.uk/ProductDetail/KEMET/T491A106M010AT?qs=VCf6WUQjPgG9lDvYXR0yBw%3D%3D; Arrow Part Number: T491A106M010AT; Arrow Price/Stock: https://www.arrow.com/en/products/t491a106m010at/kemet-corporation?region=nac
C34 C41 C46 C49 C53 C56 C59-C61 = CAP_0402: Capacitor SMD 0402; Manufacturer: *; Manufacturer Part Number: *; Distributor Link: *; LCSC: *; Rating: *; Dielectric: *
C40 C45 C48 C50-C52 C55 C58 = CAP_0201: Capacitor SMD 0201; Manufacturer: *; Manufacturer Part Number: *; Distributor Link: *; LCSC: *; Rating: *; Dielectric: *
C42 C43 C47 C54 C57 = CAP_1210: Capacitor SMD 1210; Manufacturer: *; Manufacturer Part Number: *; Distributor Link: *; LCSC: *; Rating: *; Dielectric: *
FB1-FB3 = IND_0201: Inductor SMD 0201; Manufacturer_Name: Murata Electronics; Manufacturer_Part_Number: LQP03HQ56NH02D; Datasheet Link: https://psearch.en.murata.com/inductor/product/LQP03HQ56NH02%23.html; Height: 0.42mm; Mouser Part Number: 81-LQP03HQ56NH02D; Mouser Price/Stock: https://www.mouser.co.uk/ProductDetail/Murata-Electronics/LQP03HQ56NH02D?qs=B6kkDfuK7%2FBQu1Ob9%2FT2Bg%3D%3D
IC2 = XC7Z030-2FFG676I: Integrated Circuit; Manufacturer_Name: AMD; Datasheet Link: http://www.xilinx.com/support/documentation/data_sheets/ds190-Zynq-7000-Overview.pdf; Height: 3.24mm; Manufacturer_Part_Number: XC7Z030-2FFG676I; Mouser Part Number: 217-XC7Z030-2FFG676I; Mouser Price/Stock: https://www.mouser.co.uk/ProductDetail/Xilinx/XC7Z030-2FFG676I?qs=rrS6PyfT74cuZK5O3CSpmw%3D%3D

## Sheet SOCConfiguration.SchDoc
size A4; SheetNumber: 7; SheetTotal: 18
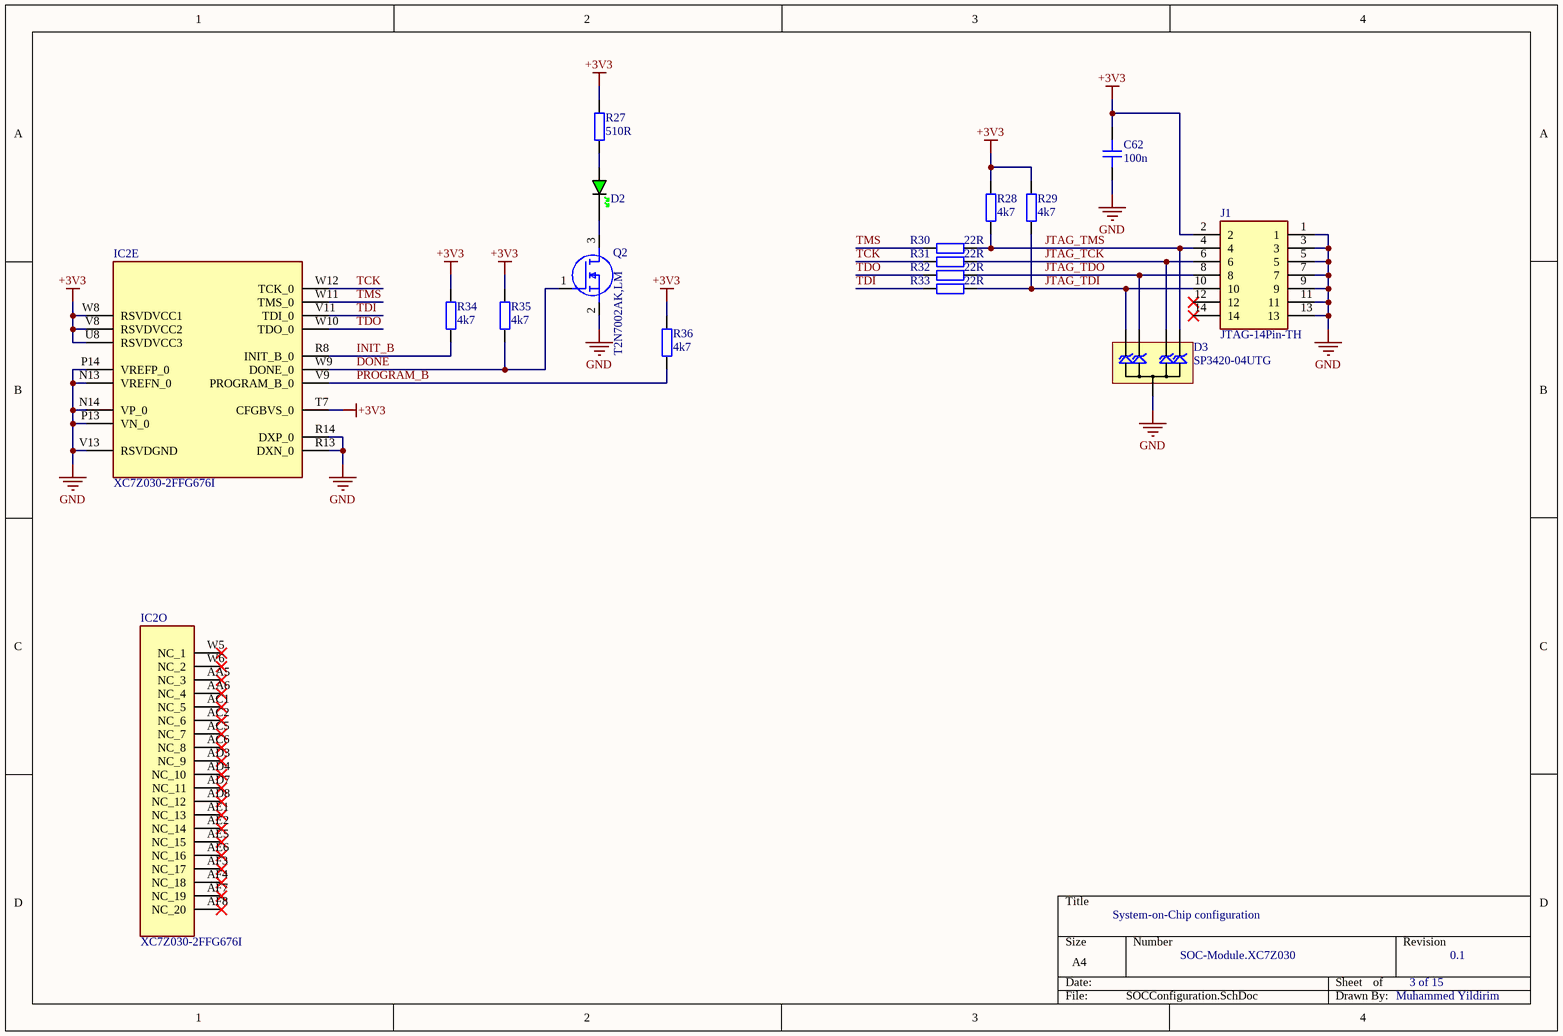
[diagram p6: SOCConfiguration.SchDoc]

### Parts
C62  100n  [CAP_0402]
D2  GREEN  [LED_0603_GREEN]  (value not drawn)
D3  SP3420-04UTG  [uDFN-10]
IC2  XC7Z030-2FFG676I  [BGA676C100P26X26_2700X2700X324]  (parts E,O of 15)
J1  JTAG-14Pin-TH  [14Pin-TH]
Q2  T2N7002AK,LM  [TBAT54CLM]
R27  510R  [RES_0603]
R28  4k7  [RES_0201]
R29  4k7  [RES_0201]
R30  22R  [RES_0201]
R31  22R  [RES_0201]
R32  22R  [RES_0201]
R33  22R  [RES_0201]
R34  4k7  [RES_0201]
R35  4k7  [RES_0201]
R36  4k7  [RES_0201]

### Nets
+3V3: C62.2 IC2.T7(CFGBVS_0) IC2.U8(RSVDVCC3) IC2.V8(RSVDVCC2) IC2.W8(RSVDVCC1) J1.2 R27.2 R28.2 R29.2 R34.2 R35.2 R36.2
GND: C62.1 D3.38(GND) IC2.N13(VREFN_0) IC2.N14(VP_0) IC2.P13(VN_0) IC2.P14(VREFP_0) IC2.R13(DXN_0) IC2.R14(DXP_0) IC2.V13(RSVDGND) J1.1 J1.3 J1.5 J1.7 J1.9 J1.11 J1.13 Q2.2(S)
DONE: IC2.W9(DONE_0) Q2.1(G) R35.1
INIT_B: IC2.R8(INIT_B_0) R34.1
JTAG_TCK: D3.47 J1.6 R31.1
JTAG_TDI: D3.110 J1.10 R29.1 R33.1
JTAG_TDO: D3.29 J1.8 R32.1
JTAG_TMS: D3.56 J1.4 R28.1 R30.1
PROGRAM_B: IC2.V9(PROGRAM_B_0) R36.1
TCK: IC2.W12(TCK_0) R31.2
TDI: IC2.V11(TDI_0) R33.2
TDO: IC2.W10(TDO_0) R32.2
TMS: IC2.W11(TMS_0) R30.2
NetD2_A: D2.A R27.1
NetD2_K: D2.K Q2.3(D)

Not connected (* = marked no-connect by the designer): IC2 AA5(NC_3)* AA6(NC_4)* AC1(NC_5)* AC2(NC_6)* AC5(NC_7)* AC6(NC_8)* AD3(NC_9)* AD4(NC_10)* AD7(NC_11)* AD8(NC_12)* AE1(NC_13)* AE2(NC_14)* AE5(NC_15)* AE6(NC_16)* AF3(NC_17)* AF4(NC_18)* AF7(NC_19)* AF8(NC_20)* W5(NC_1)* W6(NC_2)*; J1 12* 14*

### Notes on the sheet
- System-on-Chip configuration
- SOC-Module.XC7Z030
- 3 of 15
- 0.1
- Muhammed Yildirim

### Library data of the parts
C62 = CAP_0402: Capacitor SMD 0402; Manufacturer: *; Manufacturer Part Number: *; Distributor Link: *; LCSC: *; Rating: *; Dielectric: *
D2 = LED_0603_GREEN: LED 0603 GREEN SMD
D3 = SP3420-04UTG: TVS Diode Array Low Capacitance ESD Protection 4-Channel (Vwork=3V3, Vclamp=6V); Manufacturer: Littelfuse; Manufacturer Part Number: SP3420-04UTG
IC2 = XC7Z030-2FFG676I: as IC2 on sheet SOCPowerDecoupling; Datasheet Link: http://www.xilinx.com/support/documentation/data_sheets/ds190-Zynq-7000-Overview.pdf; Height: 3.24mm; Manufacturer_Part_Number: XC7Z030-2FFG676I; Mouser Part Number: 217-XC7Z030-2FFG676I; Mouser Price/Stock: https://www.mouser.co.uk/ProductDetail/Xilinx/XC7Z030-2FFG676I?qs=rrS6PyfT74cuZK5O3CSpmw%3D%3D
J1 = JTAG-14Pin-TH: Connector; Manufacturer_Name: Molex; Manufacturer_Part_Number: 87832-1416; Datasheet Link: http://uk.rs-online.com/web/p/products/6701077; Height: 7.6mm; Mouser Part Number: 538-87832-1416; Mouser Price/Stock: https://www.mouser.co.uk/ProductDetail/Molex/87832-1416?qs=kNSQ05%252BLZoDeXuSWsnDgxQ%3D%3D
Q2 = T2N7002AK,LM: as Q1 on sheet SOCPowerSupplys; Datasheet Link: http://toshiba.semicon-storage.com/info/docget.jsp?did=29712&prodName=T2N7002AK; Height: 1.1mm; Manufacturer_Part_Number: T2N7002AK,LM; Mouser Part Number: 757-T2N7002AKLM; Mouser Price/Stock: https://www.mouser.co.uk/ProductDetail/Toshiba/T2N7002AKLM?qs=pzVvXTvk9PzfX4hYglwZ9Q%3D%3D; Arrow Part Number: T2N7002AK,LM; Arrow Price/Stock: https://www.arrow.com/en/products/t2n7002aklm/toshiba?region=nac
R27 = RES_0603: Resistor SMD 0603; Manufacturer: *; Manufacturer Part Number: *; Distributor Link: *; LCSC: *
R28-R36 = RES_0201: Resistor SMD 0201; Manufacturer: *; Manufacturer Part Number: *; Distributor Link: *; LCSC: *

## Sheet PLBank12.SchDoc
size A4; SheetNumber: 8; SheetTotal: 18
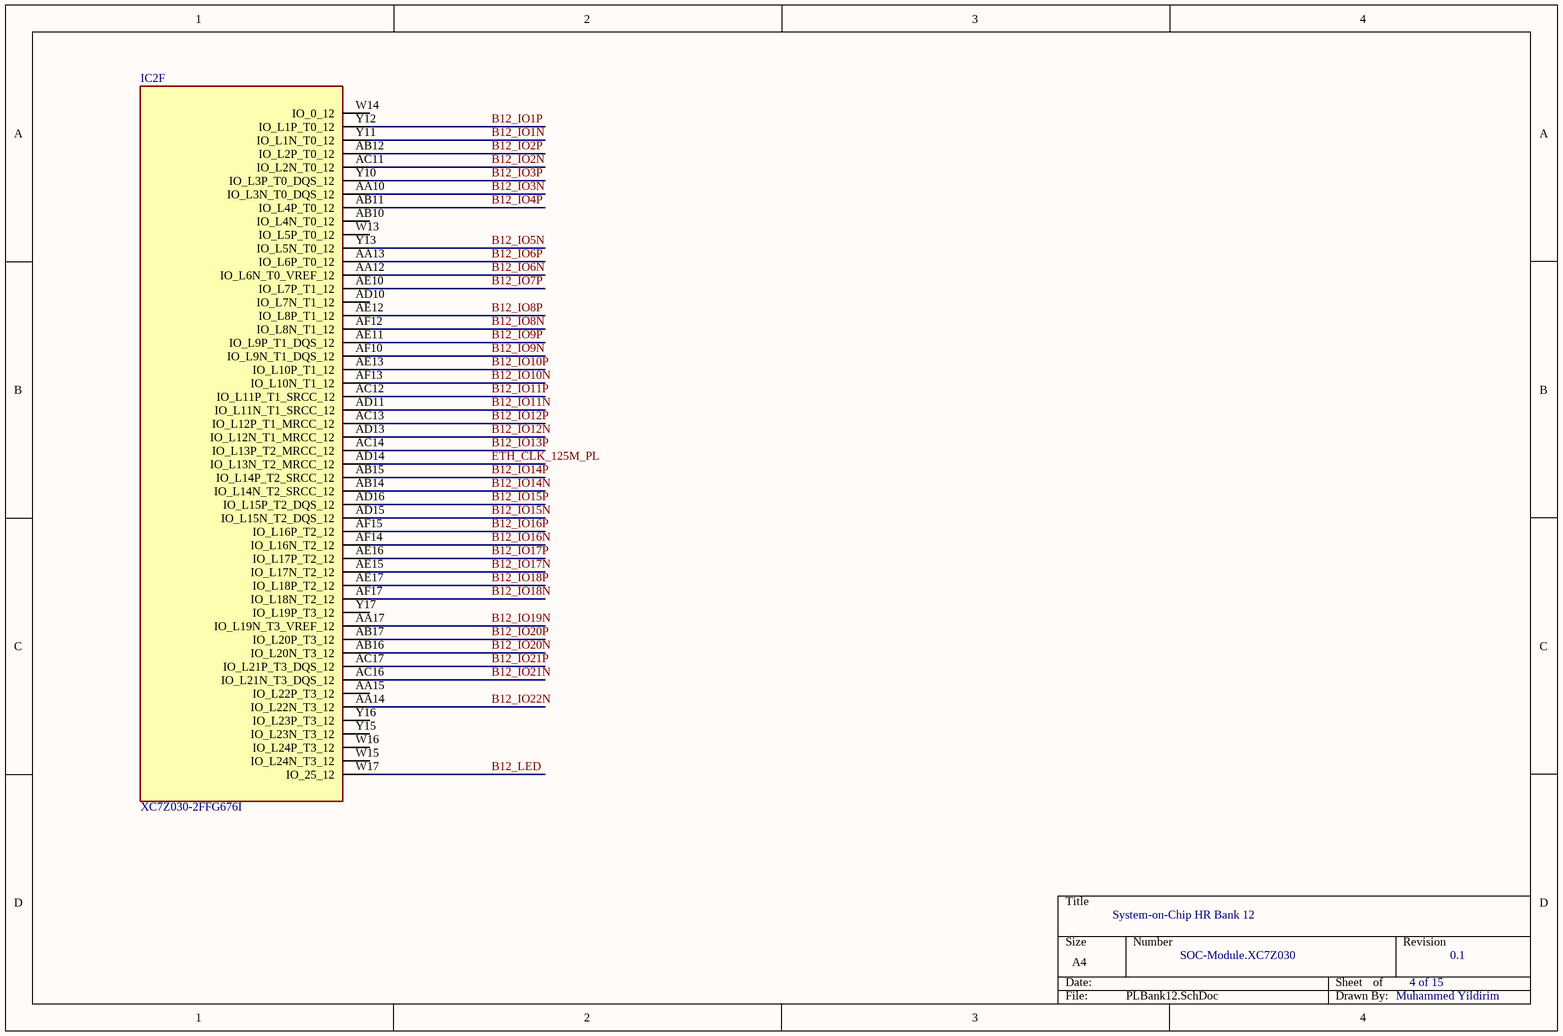
[diagram p7: PLBank12.SchDoc]

### Parts
IC2  XC7Z030-2FFG676I  [BGA676C100P26X26_2700X2700X324]  (part F of 15)

### Nets
B12_IO1N: IC2.Y11(IO_L1N_T0_12)
B12_IO1P: IC2.Y12(IO_L1P_T0_12)
B12_IO2N: IC2.AC11(IO_L2N_T0_12)
B12_IO2P: IC2.AB12(IO_L2P_T0_12)
B12_IO3N: IC2.AA10(IO_L3N_T0_DQS_12)
B12_IO3P: IC2.Y10(IO_L3P_T0_DQS_12)
B12_IO4P: IC2.AB11(IO_L4P_T0_12)
B12_IO5N: IC2.Y13(IO_L5N_T0_12)
B12_IO6N: IC2.AA12(IO_L6N_T0_VREF_12)
B12_IO6P: IC2.AA13(IO_L6P_T0_12)
B12_IO7P: IC2.AE10(IO_L7P_T1_12)
B12_IO8N: IC2.AF12(IO_L8N_T1_12)
B12_IO8P: IC2.AE12(IO_L8P_T1_12)
B12_IO9N: IC2.AF10(IO_L9N_T1_DQS_12)
B12_IO9P: IC2.AE11(IO_L9P_T1_DQS_12)
B12_IO10N: IC2.AF13(IO_L10N_T1_12)
B12_IO10P: IC2.AE13(IO_L10P_T1_12)
B12_IO11N: IC2.AD11(IO_L11N_T1_SRCC_12)
B12_IO11P: IC2.AC12(IO_L11P_T1_SRCC_12)
B12_IO12N: IC2.AD13(IO_L12N_T1_MRCC_12)
B12_IO12P: IC2.AC13(IO_L12P_T1_MRCC_12)
B12_IO13P: IC2.AC14(IO_L13P_T2_MRCC_12)
B12_IO14N: IC2.AB14(IO_L14N_T2_SRCC_12)
B12_IO14P: IC2.AB15(IO_L14P_T2_SRCC_12)
B12_IO15N: IC2.AD15(IO_L15N_T2_DQS_12)
B12_IO15P: IC2.AD16(IO_L15P_T2_DQS_12)
B12_IO16N: IC2.AF14(IO_L16N_T2_12)
B12_IO16P: IC2.AF15(IO_L16P_T2_12)
B12_IO17N: IC2.AE15(IO_L17N_T2_12)
B12_IO17P: IC2.AE16(IO_L17P_T2_12)
B12_IO18N: IC2.AF17(IO_L18N_T2_12)
B12_IO18P: IC2.AE17(IO_L18P_T2_12)
B12_IO19N: IC2.AA17(IO_L19N_T3_VREF_12)
B12_IO20N: IC2.AB16(IO_L20N_T3_12)
B12_IO20P: IC2.AB17(IO_L20P_T3_12)
B12_IO21N: IC2.AC16(IO_L21N_T3_DQS_12)
B12_IO21P: IC2.AC17(IO_L21P_T3_DQS_12)
B12_IO22N: IC2.AA14(IO_L22N_T3_12)
B12_LED: IC2.W17(IO_25_12)
ETH_CLK_125M_PL: IC2.AD14(IO_L13N_T2_MRCC_12)

Not connected (* = marked no-connect by the designer): IC2 AA15(IO_L22P_T3_12) AB10(IO_L4N_T0_12) AD10(IO_L7N_T1_12) W13(IO_L5P_T0_12) W14(IO_0_12) W15(IO_L24N_T3_12) W16(IO_L24P_T3_12) Y15(IO_L23N_T3_12) Y16(IO_L23P_T3_12) Y17(IO_L19P_T3_12)

### Notes on the sheet
- System-on-Chip HR Bank 12
- SOC-Module.XC7Z030
- 4 of 15
- 0.1
- Muhammed Yildirim

### Library data of the parts
IC2 = XC7Z030-2FFG676I: as IC2 on sheet SOCPowerDecoupling; Datasheet Link: http://www.xilinx.com/support/documentation/data_sheets/ds190-Zynq-7000-Overview.pdf; Height: 3.24mm; Manufacturer_Part_Number: XC7Z030-2FFG676I; Mouser Part Number: 217-XC7Z030-2FFG676I; Mouser Price/Stock: https://www.mouser.co.uk/ProductDetail/Xilinx/XC7Z030-2FFG676I?qs=rrS6PyfT74cuZK5O3CSpmw%3D%3D

## Sheet PLBank13.SchDoc
size A4; SheetNumber: 9; SheetTotal: 18
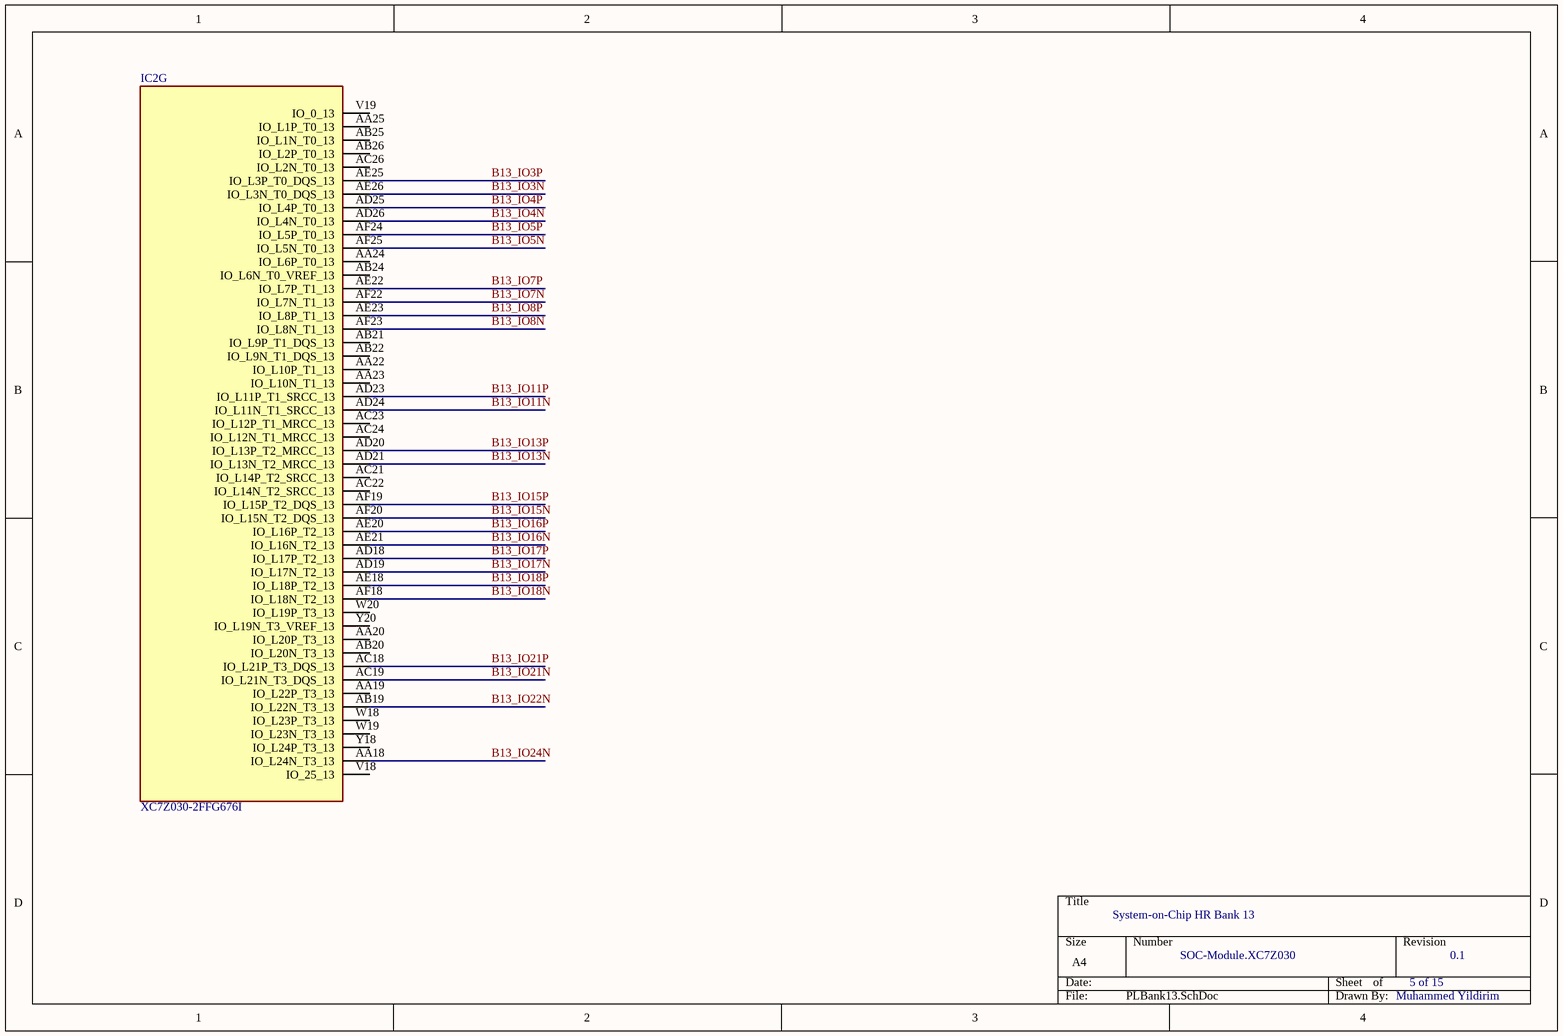
[diagram p8: PLBank13.SchDoc]

### Parts
IC2  XC7Z030-2FFG676I  [BGA676C100P26X26_2700X2700X324]  (part G of 15)

### Nets
B13_IO3N: IC2.AE26(IO_L3N_T0_DQS_13)
B13_IO3P: IC2.AE25(IO_L3P_T0_DQS_13)
B13_IO4N: IC2.AD26(IO_L4N_T0_13)
B13_IO4P: IC2.AD25(IO_L4P_T0_13)
B13_IO5N: IC2.AF25(IO_L5N_T0_13)
B13_IO5P: IC2.AF24(IO_L5P_T0_13)
B13_IO7N: IC2.AF22(IO_L7N_T1_13)
B13_IO7P: IC2.AE22(IO_L7P_T1_13)
B13_IO8N: IC2.AF23(IO_L8N_T1_13)
B13_IO8P: IC2.AE23(IO_L8P_T1_13)
B13_IO11N: IC2.AD24(IO_L11N_T1_SRCC_13)
B13_IO11P: IC2.AD23(IO_L11P_T1_SRCC_13)
B13_IO13N: IC2.AD21(IO_L13N_T2_MRCC_13)
B13_IO13P: IC2.AD20(IO_L13P_T2_MRCC_13)
B13_IO15N: IC2.AF20(IO_L15N_T2_DQS_13)
B13_IO15P: IC2.AF19(IO_L15P_T2_DQS_13)
B13_IO16N: IC2.AE21(IO_L16N_T2_13)
B13_IO16P: IC2.AE20(IO_L16P_T2_13)
B13_IO17N: IC2.AD19(IO_L17N_T2_13)
B13_IO17P: IC2.AD18(IO_L17P_T2_13)
B13_IO18N: IC2.AF18(IO_L18N_T2_13)
B13_IO18P: IC2.AE18(IO_L18P_T2_13)
B13_IO21N: IC2.AC19(IO_L21N_T3_DQS_13)
B13_IO21P: IC2.AC18(IO_L21P_T3_DQS_13)
B13_IO22N: IC2.AB19(IO_L22N_T3_13)
B13_IO24N: IC2.AA18(IO_L24N_T3_13)

Not connected (* = marked no-connect by the designer): IC2 AA19(IO_L22P_T3_13) AA20(IO_L20P_T3_13) AA22(IO_L10P_T1_13) AA23(IO_L10N_T1_13) AA24(IO_L6P_T0_13) AA25(IO_L1P_T0_13) AB20(IO_L20N_T3_13) AB21(IO_L9P_T1_DQS_13) AB22(IO_L9N_T1_DQS_13) AB24(IO_L6N_T0_VREF_13) AB25(IO_L1N_T0_13) AB26(IO_L2P_T0_13) AC21(IO_L14P_T2_SRCC_13) AC22(IO_L14N_T2_SRCC_13) AC23(IO_L12P_T1_MRCC_13) AC24(IO_L12N_T1_MRCC_13) AC26(IO_L2N_T0_13) V18(IO_25_13) V19(IO_0_13) W18(IO_L23P_T3_13) W19(IO_L23N_T3_13) W20(IO_L19P_T3_13) Y18(IO_L24P_T3_13) Y20(IO_L19N_T3_VREF_13)

### Notes on the sheet
- System-on-Chip HR Bank 13
- SOC-Module.XC7Z030
- 5 of 15
- 0.1
- Muhammed Yildirim

### Library data of the parts
IC2 = XC7Z030-2FFG676I: as IC2 on sheet SOCPowerDecoupling; Datasheet Link: http://www.xilinx.com/support/documentation/data_sheets/ds190-Zynq-7000-Overview.pdf; Height: 3.24mm; Manufacturer_Part_Number: XC7Z030-2FFG676I; Mouser Part Number: 217-XC7Z030-2FFG676I; Mouser Price/Stock: https://www.mouser.co.uk/ProductDetail/Xilinx/XC7Z030-2FFG676I?qs=rrS6PyfT74cuZK5O3CSpmw%3D%3D

## Sheet PLBank33.SchDoc
size A4; SheetNumber: 10; SheetTotal: 18
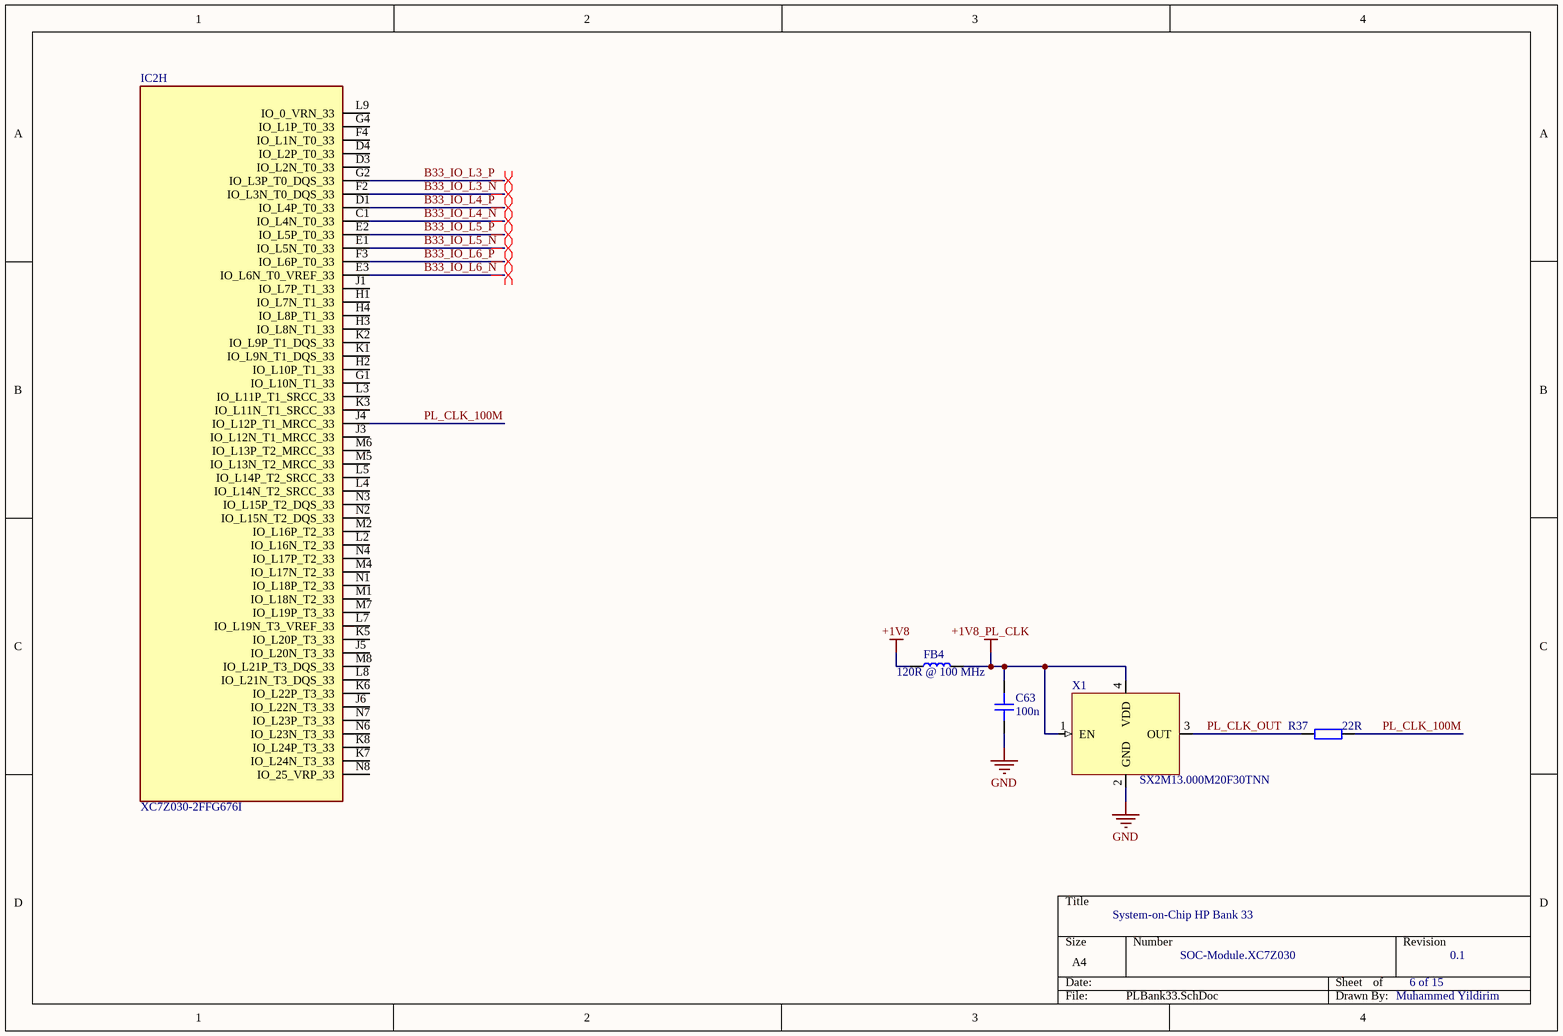
[diagram p9: PLBank33.SchDoc]

### Parts
C63  100n  [CAP_0201]
FB4  120R @ 100 MHz  [IND_0201]
IC2  XC7Z030-2FFG676I  [BGA676C100P26X26_2700X2700X324]  (part H of 15)
R37  22R  [RES_0201]
X1  SX2M13.000M20F30TNN  [XTAL_2520]

### Nets
+1V8: FB4.1
+1V8_PL_CLK: C63.1 FB4.2 X1.1(EN) X1.4(VDD)
GND: C63.2 X1.2(GND)
B33_IO_L3_N: IC2.F2(IO_L3N_T0_DQS_33)
B33_IO_L3_P: IC2.G2(IO_L3P_T0_DQS_33)
B33_IO_L4_N: IC2.C1(IO_L4N_T0_33)
B33_IO_L4_P: IC2.D1(IO_L4P_T0_33)
B33_IO_L5_N: IC2.E1(IO_L5N_T0_33)
B33_IO_L5_P: IC2.E2(IO_L5P_T0_33)
B33_IO_L6_N: IC2.E3(IO_L6N_T0_VREF_33)
B33_IO_L6_P: IC2.F3(IO_L6P_T0_33)
PL_CLK_100M: IC2.J4(IO_L12P_T1_MRCC_33) R37.2
PL_CLK_OUT: R37.1 X1.3(OUT)

Not connected (* = marked no-connect by the designer): IC2 D3(IO_L2N_T0_33) D4(IO_L2P_T0_33) F4(IO_L1N_T0_33) G1(IO_L10N_T1_33) G4(IO_L1P_T0_33) H1(IO_L7N_T1_33) H2(IO_L10P_T1_33) H3(IO_L8N_T1_33) H4(IO_L8P_T1_33) J1(IO_L7P_T1_33) J3(IO_L12N_T1_MRCC_33) J5(IO_L20N_T3_33) J6(IO_L22N_T3_33) K1(IO_L9N_T1_DQS_33) K2(IO_L9P_T1_DQS_33) K3(IO_L11N_T1_SRCC_33) K5(IO_L20P_T3_33) K6(IO_L22P_T3_33) K7(IO_L24N_T3_33) K8(IO_L24P_T3_33) L2(IO_L16N_T2_33) L3(IO_L11P_T1_SRCC_33) L4(IO_L14N_T2_SRCC_33) L5(IO_L14P_T2_SRCC_33) L7(IO_L19N_T3_VREF_33) L8(IO_L21N_T3_DQS_33) L9(IO_0_VRN_33) M1(IO_L18N_T2_33) M2(IO_L16P_T2_33) M4(IO_L17N_T2_33) M5(IO_L13N_T2_MRCC_33) M6(IO_L13P_T2_MRCC_33) M7(IO_L19P_T3_33) M8(IO_L21P_T3_DQS_33) N1(IO_L18P_T2_33) N2(IO_L15N_T2_DQS_33) N3(IO_L15P_T2_DQS_33) N4(IO_L17P_T2_33) N6(IO_L23N_T3_33) N7(IO_L23P_T3_33) N8(IO_25_VRP_33)

### Layout directives
differential pair: B33_IO_L3_N, B33_IO_L3_P, B33_IO_L4_N, B33_IO_L4_P, B33_IO_L5_N, B33_IO_L5_P, B33_IO_L6_N, B33_IO_L6_P

### Notes on the sheet
- System-on-Chip HP Bank 33
- SOC-Module.XC7Z030
- 6 of 15
- 0.1
- Muhammed Yildirim

### Library data of the parts
C63 = CAP_0201: Capacitor SMD 0201; Manufacturer: *; Manufacturer Part Number: *; Distributor Link: *; LCSC: *; Rating: *; Dielectric: *
FB4 = IND_0201: as FB1 on sheet SOCPowerDecoupling; Datasheet Link: https://psearch.en.murata.com/inductor/product/LQP03HQ56NH02%23.html; Height: 0.42mm; Mouser Part Number: 81-LQP03HQ56NH02D; Mouser Price/Stock: https://www.mouser.co.uk/ProductDetail/Murata-Electronics/LQP03HQ56NH02D?qs=B6kkDfuK7%2FBQu1Ob9%2FT2Bg%3D%3D
IC2 = XC7Z030-2FFG676I: as IC2 on sheet SOCPowerDecoupling; Datasheet Link: http://www.xilinx.com/support/documentation/data_sheets/ds190-Zynq-7000-Overview.pdf; Height: 3.24mm; Manufacturer_Part_Number: XC7Z030-2FFG676I; Mouser Part Number: 217-XC7Z030-2FFG676I; Mouser Price/Stock: https://www.mouser.co.uk/ProductDetail/Xilinx/XC7Z030-2FFG676I?qs=rrS6PyfT74cuZK5O3CSpmw%3D%3D
R37 = RES_0201: Resistor SMD 0201; Manufacturer: *; Manufacturer Part Number: *; Distributor Link: *; LCSC: *
X1 = ECS-2520MV-130-BN-TR: Standard Clock Oscillators XO (Standard),13MHz,Standby (Power Down),CMOS, Multi-Volt,1.6 V 3.6 V,+/-50ppm,-40 C 85 C,6mA,Surface Mount,4-SMD, No Lead,(2.50mm x 2.00mm),(0.80mm); Manufacturer: ECS; Manufacturer Part Number: ECS-2520MV-130-BN-TR

## Sheet PLBank34.SchDoc
size A4; SheetNumber: 11; SheetTotal: 18
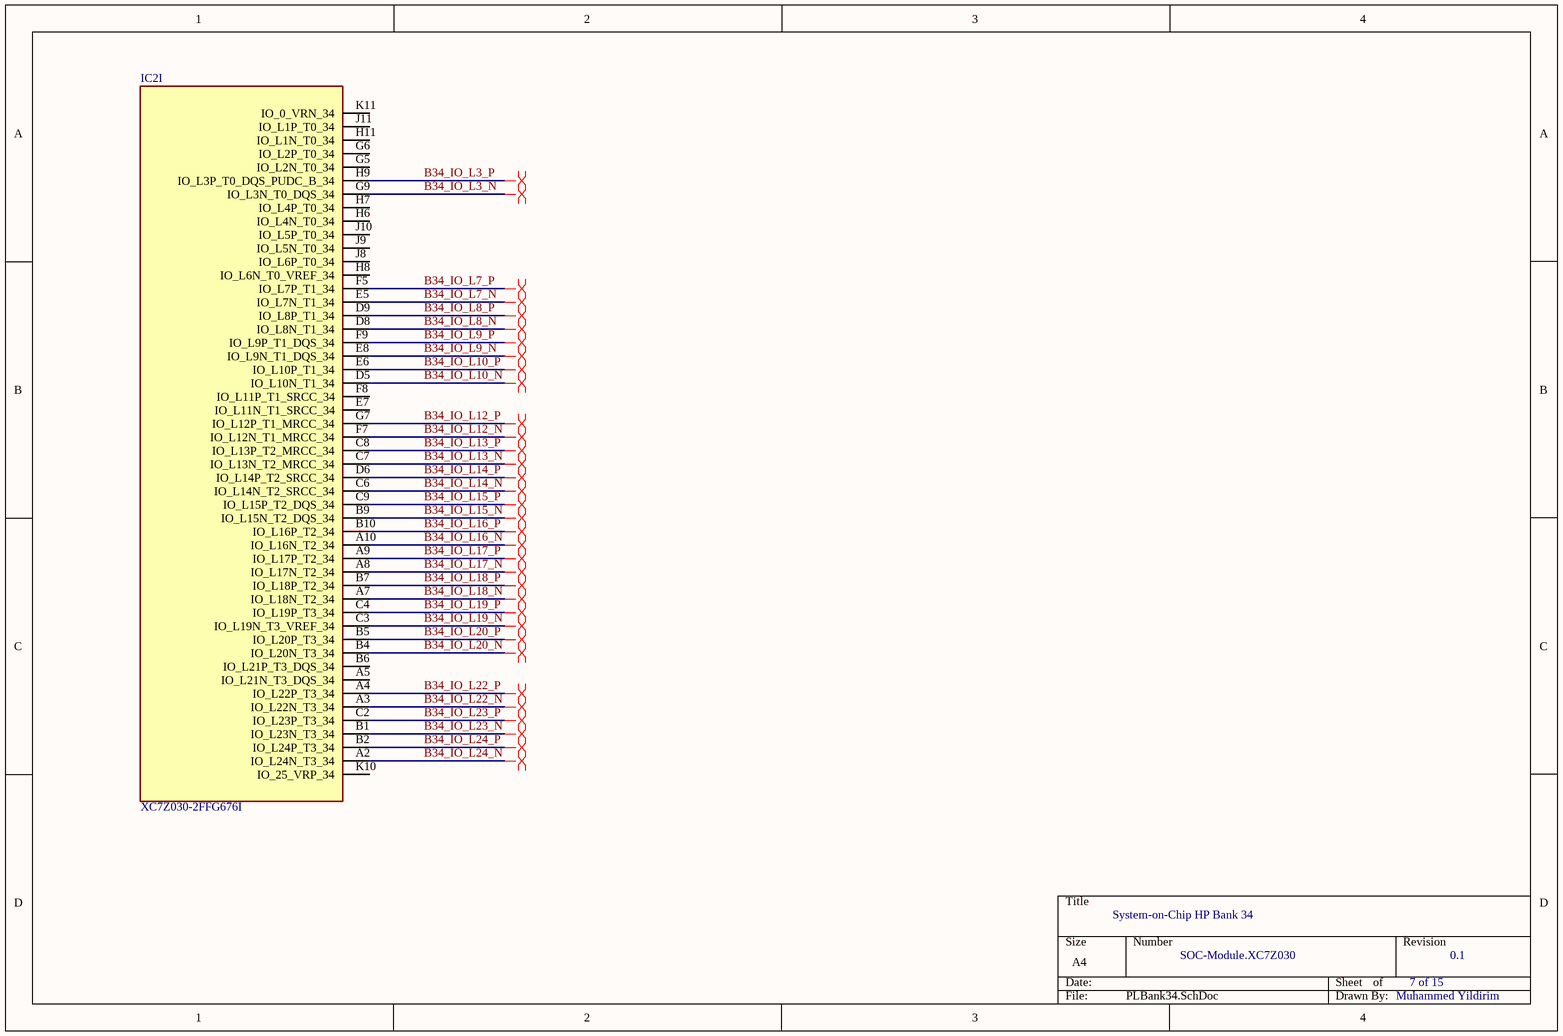
[diagram p10: PLBank34.SchDoc]

### Parts
IC2  XC7Z030-2FFG676I  [BGA676C100P26X26_2700X2700X324]  (part I of 15)

### Nets
B34_IO_L3_N: IC2.G9(IO_L3N_T0_DQS_34)
B34_IO_L3_P: IC2.H9(IO_L3P_T0_DQS_PUDC_B_34)
B34_IO_L7_N: IC2.E5(IO_L7N_T1_34)
B34_IO_L7_P: IC2.F5(IO_L7P_T1_34)
B34_IO_L8_N: IC2.D8(IO_L8N_T1_34)
B34_IO_L8_P: IC2.D9(IO_L8P_T1_34)
B34_IO_L9_N: IC2.E8(IO_L9N_T1_DQS_34)
B34_IO_L9_P: IC2.F9(IO_L9P_T1_DQS_34)
B34_IO_L10_N: IC2.D5(IO_L10N_T1_34)
B34_IO_L10_P: IC2.E6(IO_L10P_T1_34)
B34_IO_L12_N: IC2.F7(IO_L12N_T1_MRCC_34)
B34_IO_L12_P: IC2.G7(IO_L12P_T1_MRCC_34)
B34_IO_L13_N: IC2.C7(IO_L13N_T2_MRCC_34)
B34_IO_L13_P: IC2.C8(IO_L13P_T2_MRCC_34)
B34_IO_L14_N: IC2.C6(IO_L14N_T2_SRCC_34)
B34_IO_L14_P: IC2.D6(IO_L14P_T2_SRCC_34)
B34_IO_L15_N: IC2.B9(IO_L15N_T2_DQS_34)
B34_IO_L15_P: IC2.C9(IO_L15P_T2_DQS_34)
B34_IO_L16_N: IC2.A10(IO_L16N_T2_34)
B34_IO_L16_P: IC2.B10(IO_L16P_T2_34)
B34_IO_L17_N: IC2.A8(IO_L17N_T2_34)
B34_IO_L17_P: IC2.A9(IO_L17P_T2_34)
B34_IO_L18_N: IC2.A7(IO_L18N_T2_34)
B34_IO_L18_P: IC2.B7(IO_L18P_T2_34)
B34_IO_L19_N: IC2.C3(IO_L19N_T3_VREF_34)
B34_IO_L19_P: IC2.C4(IO_L19P_T3_34)
B34_IO_L20_N: IC2.B4(IO_L20N_T3_34)
B34_IO_L20_P: IC2.B5(IO_L20P_T3_34)
B34_IO_L22_N: IC2.A3(IO_L22N_T3_34)
B34_IO_L22_P: IC2.A4(IO_L22P_T3_34)
B34_IO_L23_N: IC2.B1(IO_L23N_T3_34)
B34_IO_L23_P: IC2.C2(IO_L23P_T3_34)
B34_IO_L24_N: IC2.A2(IO_L24N_T3_34)
B34_IO_L24_P: IC2.B2(IO_L24P_T3_34)

Not connected (* = marked no-connect by the designer): IC2 A5(IO_L21N_T3_DQS_34) B6(IO_L21P_T3_DQS_34) E7(IO_L11N_T1_SRCC_34) F8(IO_L11P_T1_SRCC_34) G5(IO_L2N_T0_34) G6(IO_L2P_T0_34) H6(IO_L4N_T0_34) H7(IO_L4P_T0_34) H8(IO_L6N_T0_VREF_34) H11(IO_L1N_T0_34) J8(IO_L6P_T0_34) J9(IO_L5N_T0_34) J10(IO_L5P_T0_34) J11(IO_L1P_T0_34) K10(IO_25_VRP_34) K11(IO_0_VRN_34)

### Layout directives
differential pair: B34_IO_L3_N, B34_IO_L3_P, B34_IO_L7_N, B34_IO_L7_P, B34_IO_L8_N, B34_IO_L8_P, B34_IO_L9_N, B34_IO_L9_P, B34_IO_L10_N, B34_IO_L10_P, B34_IO_L12_N, B34_IO_L12_P, B34_IO_L13_N, B34_IO_L13_P, B34_IO_L14_N, B34_IO_L14_P, B34_IO_L15_N, B34_IO_L15_P, B34_IO_L16_N, B34_IO_L16_P, B34_IO_L17_N, B34_IO_L17_P, B34_IO_L18_N, B34_IO_L18_P, B34_IO_L19_N, B34_IO_L19_P, B34_IO_L20_N, B34_IO_L20_P, B34_IO_L22_N, B34_IO_L22_P, B34_IO_L23_N, B34_IO_L23_P, B34_IO_L24_N, B34_IO_L24_P

### Notes on the sheet
- System-on-Chip HP Bank 34
- SOC-Module.XC7Z030
- 7 of 15
- 0.1
- Muhammed Yildirim

### Library data of the parts
IC2 = XC7Z030-2FFG676I: as IC2 on sheet SOCPowerDecoupling; Datasheet Link: http://www.xilinx.com/support/documentation/data_sheets/ds190-Zynq-7000-Overview.pdf; Height: 3.24mm; Manufacturer_Part_Number: XC7Z030-2FFG676I; Mouser Part Number: 217-XC7Z030-2FFG676I; Mouser Price/Stock: https://www.mouser.co.uk/ProductDetail/Xilinx/XC7Z030-2FFG676I?qs=rrS6PyfT74cuZK5O3CSpmw%3D%3D

## Sheet PLBank35.SchDoc
size A4; SheetNumber: 12; SheetTotal: 18
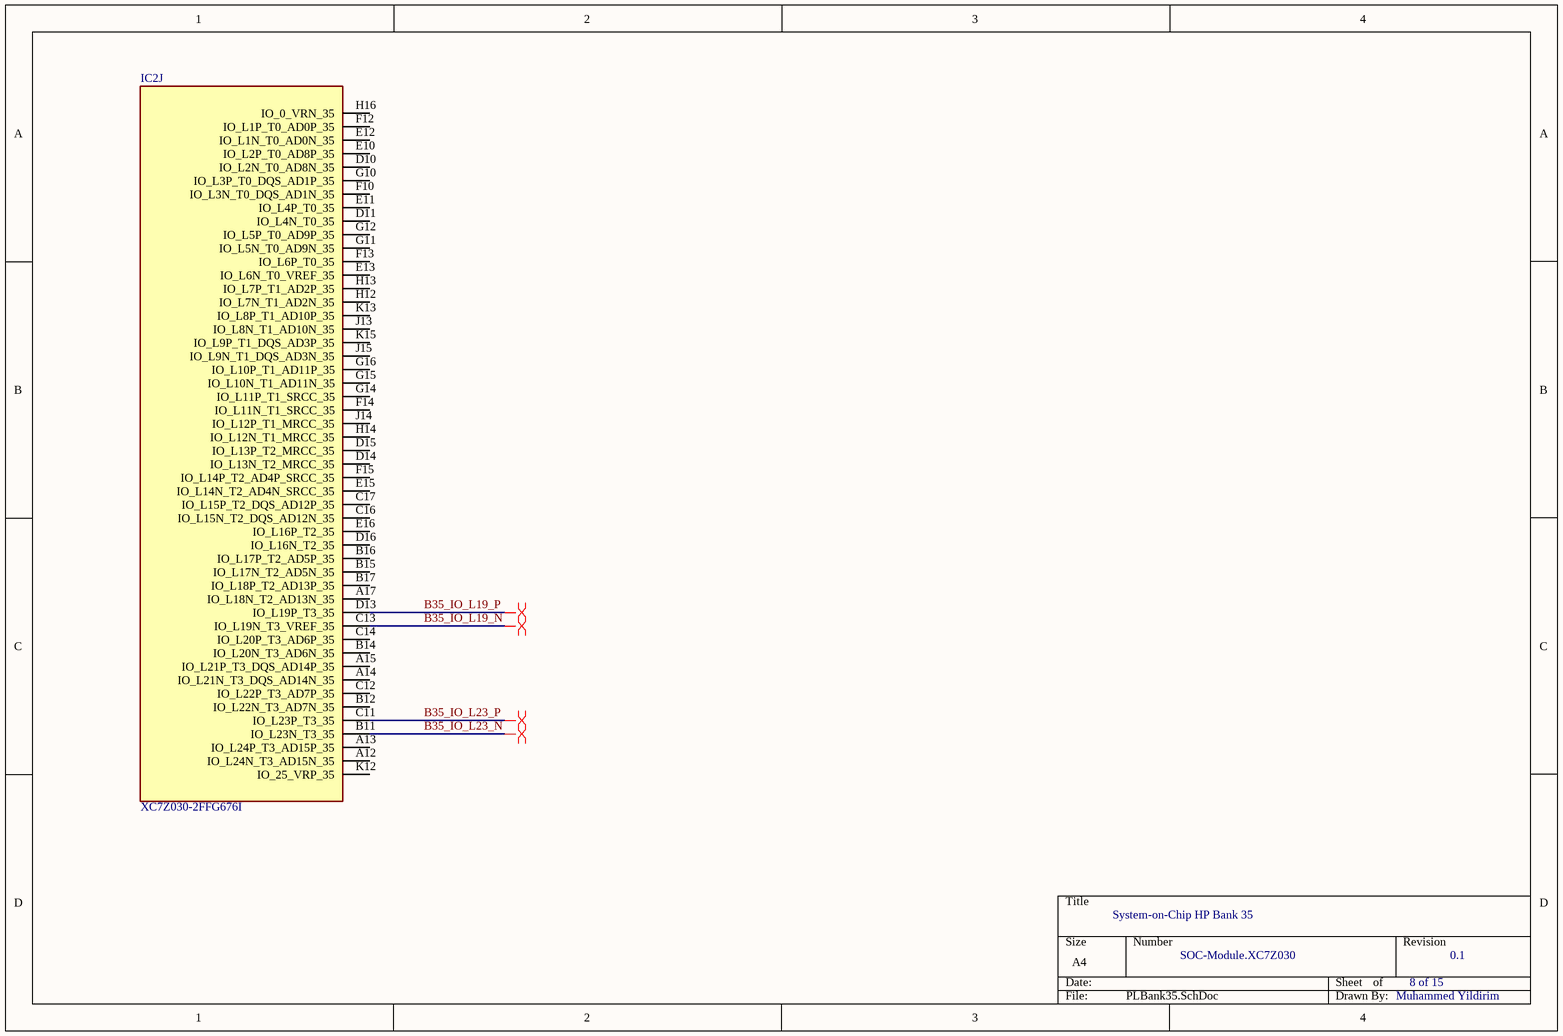
[diagram p11: PLBank35.SchDoc]

### Parts
IC2  XC7Z030-2FFG676I  [BGA676C100P26X26_2700X2700X324]  (part J of 15)

### Nets
B35_IO_L19_N: IC2.C13(IO_L19N_T3_VREF_35)
B35_IO_L19_P: IC2.D13(IO_L19P_T3_35)
B35_IO_L23_N: IC2.B11(IO_L23N_T3_35)
B35_IO_L23_P: IC2.C11(IO_L23P_T3_35)

Not connected (* = marked no-connect by the designer): IC2 A12(IO_L24N_T3_AD15N_35) A13(IO_L24P_T3_AD15P_35) A14(IO_L21N_T3_DQS_AD14N_35) A15(IO_L21P_T3_DQS_AD14P_35) A17(IO_L18N_T2_AD13N_35) B12(IO_L22N_T3_AD7N_35) B14(IO_L20N_T3_AD6N_35) B15(IO_L17N_T2_AD5N_35) B16(IO_L17P_T2_AD5P_35) B17(IO_L18P_T2_AD13P_35) C12(IO_L22P_T3_AD7P_35) C14(IO_L20P_T3_AD6P_35) C16(IO_L15N_T2_DQS_AD12N_35) C17(IO_L15P_T2_DQS_AD12P_35) D10(IO_L2N_T0_AD8N_35) D11(IO_L4N_T0_35) D14(IO_L13N_T2_MRCC_35) D15(IO_L13P_T2_MRCC_35) D16(IO_L16N_T2_35) E10(IO_L2P_T0_AD8P_35) E11(IO_L4P_T0_35) E12(IO_L1N_T0_AD0N_35) E13(IO_L6N_T0_VREF_35) E15(IO_L14N_T2_AD4N_SRCC_35) E16(IO_L16P_T2_35) F10(IO_L3N_T0_DQS_AD1N_35) F12(IO_L1P_T0_AD0P_35) F13(IO_L6P_T0_35) F14(IO_L11N_T1_SRCC_35) F15(IO_L14P_T2_AD4P_SRCC_35) G10(IO_L3P_T0_DQS_AD1P_35) G11(IO_L5N_T0_AD9N_35) G12(IO_L5P_T0_AD9P_35) G14(IO_L11P_T1_SRCC_35) G15(IO_L10N_T1_AD11N_35) G16(IO_L10P_T1_AD11P_35) H12(IO_L7N_T1_AD2N_35) H13(IO_L7P_T1_AD2P_35) H14(IO_L12N_T1_MRCC_35) H16(IO_0_VRN_35) J13(IO_L8N_T1_AD10N_35) J14(IO_L12P_T1_MRCC_35) J15(IO_L9N_T1_DQS_AD3N_35) K12(IO_25_VRP_35) K13(IO_L8P_T1_AD10P_35) K15(IO_L9P_T1_DQS_AD3P_35)

### Layout directives
differential pair: B35_IO_L19_N, B35_IO_L19_P, B35_IO_L23_N, B35_IO_L23_P

### Notes on the sheet
- System-on-Chip HP Bank 35
- SOC-Module.XC7Z030
- 8 of 15
- 0.1
- Muhammed Yildirim

### Library data of the parts
IC2 = XC7Z030-2FFG676I: as IC2 on sheet SOCPowerDecoupling; Datasheet Link: http://www.xilinx.com/support/documentation/data_sheets/ds190-Zynq-7000-Overview.pdf; Height: 3.24mm; Manufacturer_Part_Number: XC7Z030-2FFG676I; Mouser Part Number: 217-XC7Z030-2FFG676I; Mouser Price/Stock: https://www.mouser.co.uk/ProductDetail/Xilinx/XC7Z030-2FFG676I?qs=rrS6PyfT74cuZK5O3CSpmw%3D%3D

## Sheet PLMGTBanks.SchDoc
size A4; SheetNumber: 13; SheetTotal: 18
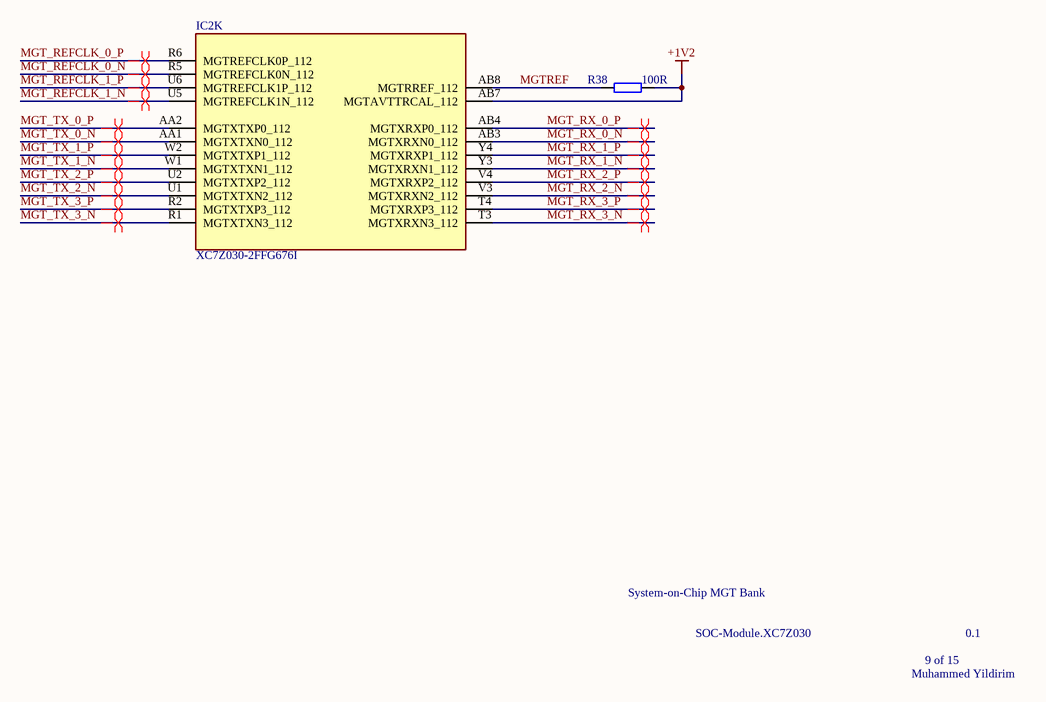
[diagram p12: PLMGTBanks.SchDoc]

### Parts
IC2  XC7Z030-2FFG676I  [BGA676C100P26X26_2700X2700X324]  (part K of 15)
R38  100R  [RES_0201]

### Nets
+1V2: IC2.AB7(MGTAVTTRCAL_112) R38.2
MGT_REFCLK_0_N: IC2.R5(MGTREFCLK0N_112)
MGT_REFCLK_0_P: IC2.R6(MGTREFCLK0P_112)
MGT_REFCLK_1_N: IC2.U5(MGTREFCLK1N_112)
MGT_REFCLK_1_P: IC2.U6(MGTREFCLK1P_112)
MGT_RX_0_N: IC2.AB3(MGTXRXN0_112)
MGT_RX_0_P: IC2.AB4(MGTXRXP0_112)
MGT_RX_1_N: IC2.Y3(MGTXRXN1_112)
MGT_RX_1_P: IC2.Y4(MGTXRXP1_112)
MGT_RX_2_N: IC2.V3(MGTXRXN2_112)
MGT_RX_2_P: IC2.V4(MGTXRXP2_112)
MGT_RX_3_N: IC2.T3(MGTXRXN3_112)
MGT_RX_3_P: IC2.T4(MGTXRXP3_112)
MGT_TX_0_N: IC2.AA1(MGTXTXN0_112)
MGT_TX_0_P: IC2.AA2(MGTXTXP0_112)
MGT_TX_1_N: IC2.W1(MGTXTXN1_112)
MGT_TX_1_P: IC2.W2(MGTXTXP1_112)
MGT_TX_2_N: IC2.U1(MGTXTXN2_112)
MGT_TX_2_P: IC2.U2(MGTXTXP2_112)
MGT_TX_3_N: IC2.R1(MGTXTXN3_112)
MGT_TX_3_P: IC2.R2(MGTXTXP3_112)
MGTREF: IC2.AB8(MGTRREF_112) R38.1

### Layout directives
differential pair: MGT_REFCLK_0_N, MGT_REFCLK_0_P, MGT_REFCLK_1_N, MGT_REFCLK_1_P, MGT_RX_0_N, MGT_RX_0_P, MGT_RX_1_N, MGT_RX_1_P, MGT_RX_2_N, MGT_RX_2_P, MGT_RX_3_N, MGT_RX_3_P, MGT_TX_0_N, MGT_TX_0_P, MGT_TX_1_N, MGT_TX_1_P, MGT_TX_2_N, MGT_TX_2_P, MGT_TX_3_N, MGT_TX_3_P

### Notes on the sheet
- System-on-Chip MGT Bank
- SOC-Module.XC7Z030
- 9 of 15
- 0.1
- Muhammed Yildirim

### Library data of the parts
IC2 = XC7Z030-2FFG676I: as IC2 on sheet SOCPowerDecoupling; Datasheet Link: http://www.xilinx.com/support/documentation/data_sheets/ds190-Zynq-7000-Overview.pdf; Height: 3.24mm; Manufacturer_Part_Number: XC7Z030-2FFG676I; Mouser Part Number: 217-XC7Z030-2FFG676I; Mouser Price/Stock: https://www.mouser.co.uk/ProductDetail/Xilinx/XC7Z030-2FFG676I?qs=rrS6PyfT74cuZK5O3CSpmw%3D%3D
R38 = RES_0201: Resistor SMD 0201; Manufacturer: *; Manufacturer Part Number: *; Distributor Link: *; LCSC: *

## Sheet SOCPSBanks.SchDoc
size A3; SheetNumber: 14; SheetTotal: 18
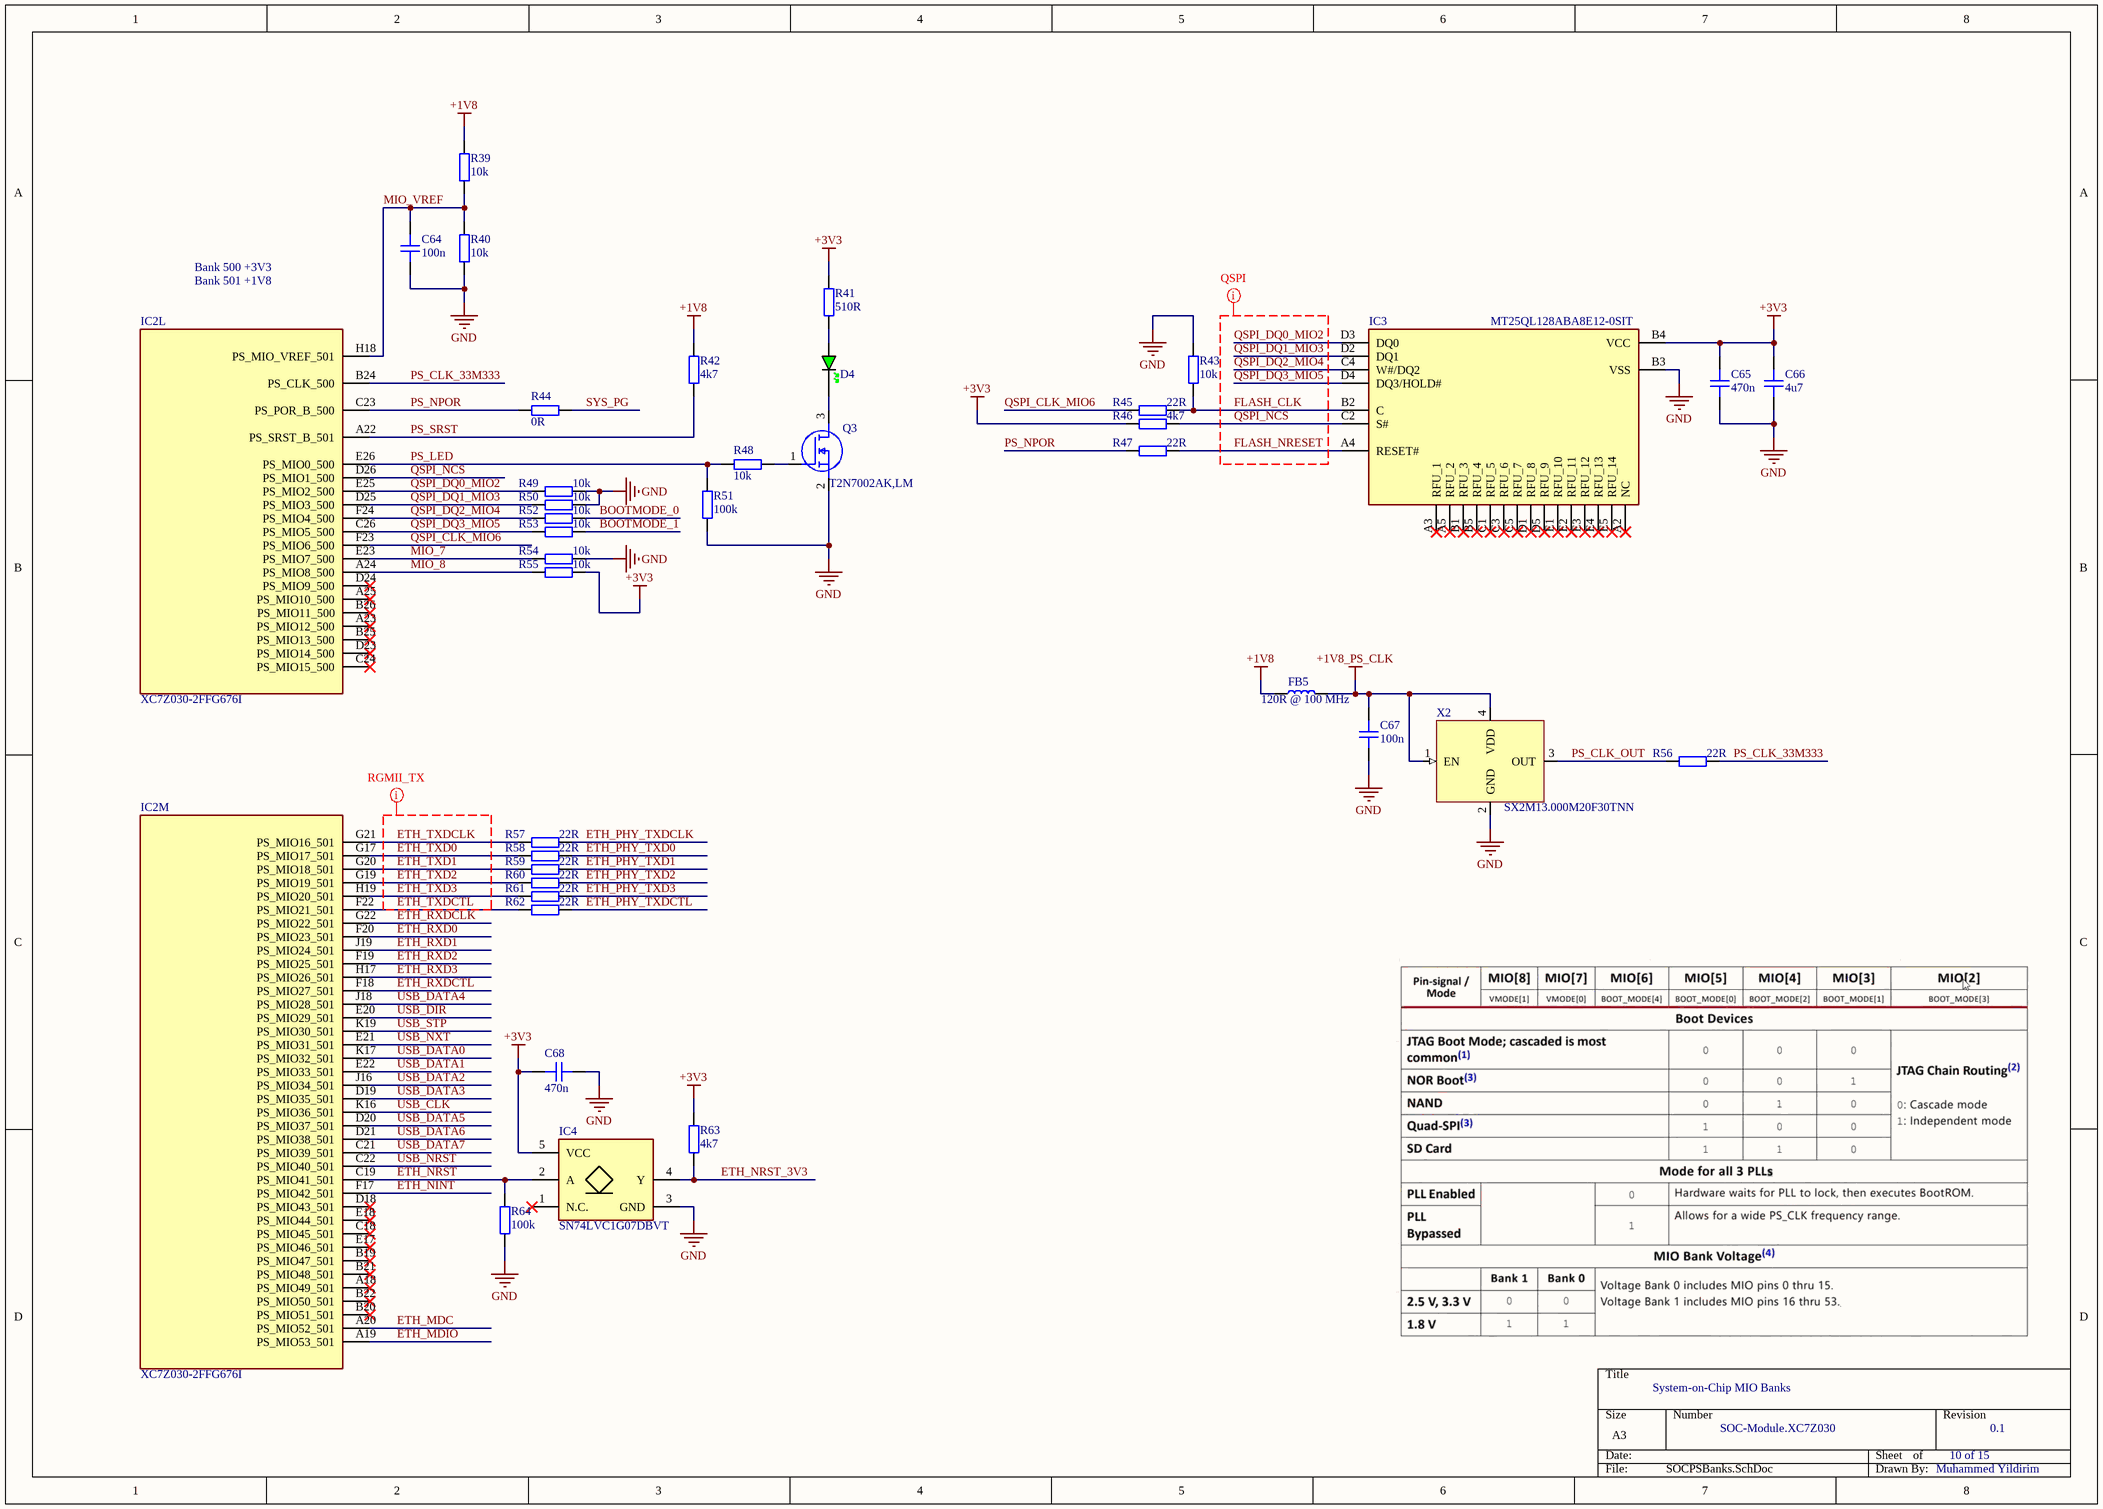
[diagram p13: SOCPSBanks.SchDoc]

### Parts
C64  100n  [CAP_0201]
C65  470n  [CAP_0201]
C66  4u7  [CAP_0402]
C67  100n  [CAP_0201]
C68  470n  [CAP_0201]
D4  GREEN  [LED_0603_GREEN]  (value not drawn)
FB5  120R @ 100 MHz  [IND_0201]
IC2  XC7Z030-2FFG676I  [BGA676C100P26X26_2700X2700X324]  (parts L,M of 15)
IC3  MT25QL128ABA8E12-0SIT  [BGA24C100P5X5_600X800X120]
IC4  SN74LVC1G07DBVT  [SOT95P280X145-5N]
Q3  T2N7002AK,LM  [TBAT54CLM]
R39  10k  [RES_0201]
R40  10k  [RES_0201]
R41  510R  [RES_0603]
R42  4k7  [RES_0201]
R43  10k  [RES_0201]
R44  0R  [RES_0402]
R45  22R  [RES_0201]
R46  4k7  [RES_0201]
R47  22R  [RES_0201]
R48  10k  [RES_0201]
R49  10k  [RES_0201]
R50  10k  [RES_0201]
R51  100k  [RES_0201]
R52  10k  [RES_0201]
R53  10k  [RES_0201]
R54  10k  [RES_0201]
R55  10k  [RES_0201]
R56  22R  [RES_0201]
R57  22R  [RES_0201]
R58  22R  [RES_0201]
R59  22R  [RES_0201]
R60  22R  [RES_0201]
R61  22R  [RES_0201]
R62  22R  [RES_0201]
R63  4k7  [RES_0201]
R64  100k  [RES_0201]
X2  SX2M13.000M20F30TNN  [XTAL_2520]

### Nets
+1V8: FB5.1 R39.1 R42.2
+1V8_PS_CLK: C67.1 FB5.2 X2.1(EN) X2.4(VDD)
+3V3: C65.2 C66.2 C68.2 IC3.B4(VCC) IC4.5(VCC) R41.2 R46.2 R55.1 R63.2
GND: C64.2 C65.1 C66.1 C67.2 C68.1 IC3.B3(VSS) IC4.3(GND) Q3.2(S) R40.2 R43.1 R49.1 R50.1 R51.1 R54.1 R64.1 X2.2(GND)
BOOTMODE_0: R52.1
BOOTMODE_1: R53.1
ETH_MDC: IC2.A20(PS_MIO52_501)
ETH_MDIO: IC2.A19(PS_MIO53_501)
ETH_NINT: IC2.F17(PS_MIO42_501)
ETH_NRST: IC2.C19(PS_MIO41_501) IC4.2(A) R64.2
ETH_NRST_3V3: IC4.4(Y) R63.1
ETH_PHY_TXD0: R58.1
ETH_PHY_TXD1: R59.1
ETH_PHY_TXD2: R60.1
ETH_PHY_TXD3: R61.1
ETH_PHY_TXDCLK: R57.1
ETH_PHY_TXDCTL: R62.1
ETH_RXD0: IC2.F20(PS_MIO23_501)
ETH_RXD1: IC2.J19(PS_MIO24_501)
ETH_RXD2: IC2.F19(PS_MIO25_501)
ETH_RXD3: IC2.H17(PS_MIO26_501)
ETH_RXDCLK: IC2.G22(PS_MIO22_501)
ETH_RXDCTL: IC2.F18(PS_MIO27_501)
ETH_TXD0: IC2.G17(PS_MIO17_501) R58.2
ETH_TXD1: IC2.G20(PS_MIO18_501) R59.2
ETH_TXD2: IC2.G19(PS_MIO19_501) R60.2
ETH_TXD3: IC2.H19(PS_MIO20_501) R61.2
ETH_TXDCLK: IC2.G21(PS_MIO16_501) R57.2
ETH_TXDCTL: IC2.F22(PS_MIO21_501) R62.2
FLASH_CLK: IC3.B2(C) R43.2 R45.1
FLASH_NRESET: IC3.A4(RESET#) R47.1
MIO_7: IC2.E23(PS_MIO7_500) R54.2
MIO_8: IC2.A24(PS_MIO8_500) R55.2
MIO_VREF: C64.1 IC2.H18(PS_MIO_VREF_501) R39.2 R40.1
PS_CLK_33M333: IC2.B24(PS_CLK_500) R56.2
PS_CLK_OUT: R56.1 X2.3(OUT)
PS_LED: IC2.E26(PS_MIO0_500) R48.2 R51.2
PS_NPOR: IC2.C23(PS_POR_B_500) R44.2 R47.2
PS_SRST: IC2.A22(PS_SRST_B_501) R42.1
QSPI_CLK_MIO6: IC2.F23(PS_MIO6_500) R45.2
QSPI_DQ0_MIO2: IC2.E25(PS_MIO2_500) IC3.D3(DQ0) R49.2
QSPI_DQ1_MIO3: IC2.D25(PS_MIO3_500) IC3.D2(DQ1) R50.2
QSPI_DQ2_MIO4: IC2.F24(PS_MIO4_500) IC3.C4(W#/DQ2) R52.2
QSPI_DQ3_MIO5: IC2.C26(PS_MIO5_500) IC3.D4(DQ3/HOLD#) R53.2
QSPI_NCS: IC2.D26(PS_MIO1_500) IC3.C2(S#) R46.1
SYS_PG: R44.1
USB_CLK: IC2.K16(PS_MIO36_501)
USB_DATA0: IC2.K17(PS_MIO32_501)
USB_DATA1: IC2.E22(PS_MIO33_501)
USB_DATA2: IC2.J16(PS_MIO34_501)
USB_DATA3: IC2.D19(PS_MIO35_501)
USB_DATA4: IC2.J18(PS_MIO28_501)
USB_DATA5: IC2.D20(PS_MIO37_501)
USB_DATA6: IC2.D21(PS_MIO38_501)
USB_DATA7: IC2.C21(PS_MIO39_501)
USB_DIR: IC2.E20(PS_MIO29_501)
USB_NRST: IC2.C22(PS_MIO40_501)
USB_NXT: IC2.E21(PS_MIO31_501)
USB_STP: IC2.K19(PS_MIO30_501)
NetD4_A: D4.A R41.1
NetD4_K: D4.K Q3.3(D)
NetQ3_1: Q3.1(G) R48.1

Not connected (* = marked no-connect by the designer): IC2 A18(PS_MIO49_501)* A23(PS_MIO12_500)* A25(PS_MIO10_500)* B19(PS_MIO47_501)* B20(PS_MIO51_501)* B21(PS_MIO48_501)* B22(PS_MIO50_501)* B25(PS_MIO13_500)* B26(PS_MIO11_500)* C18(PS_MIO45_501)* C24(PS_MIO15_500)* D18(PS_MIO43_501)* D23(PS_MIO14_500)* D24(PS_MIO9_500)* E17(PS_MIO46_501)* E18(PS_MIO44_501)*; IC3 A2(NC)* A3(RFU_1)* A5(RFU_2)* B1(RFU_3)* B5(RFU_4)* C1(RFU_5)* C3(RFU_6)* C5(RFU_7)* D1(RFU_8)* D5(RFU_9)* E1(RFU_10)* E2(RFU_11)* E3(RFU_12)* E4(RFU_13)* E5(RFU_14)*; IC4 1(N.C.)*

### Layout directives
mark named QSPI: FLASH_CLK, FLASH_NRESET, QSPI_DQ0_MIO2, QSPI_DQ1_MIO3, QSPI_DQ2_MIO4, QSPI_DQ3_MIO5, QSPI_NCS
mark named RGMII_TX: ETH_TXD0, ETH_TXD1, ETH_TXD2, ETH_TXD3, ETH_TXDCLK, ETH_TXDCTL

### Notes on the sheet
- Bank 500 +3V3
- Bank 501 +1V8
- System-on-Chip MIO Banks
- SOC-Module.XC7Z030
- 10 of 15
- 0.1
- Muhammed Yildirim

### Library data of the parts
C64 C65 C67 C68 = CAP_0201: Capacitor SMD 0201; Manufacturer: *; Manufacturer Part Number: *; Distributor Link: *; LCSC: *; Rating: *; Dielectric: *
C66 = CAP_0402: Capacitor SMD 0402; Manufacturer: *; Manufacturer Part Number: *; Distributor Link: *; LCSC: *; Rating: *; Dielectric: *
D4 = LED_0603_GREEN: LED 0603 GREEN SMD
FB5 = IND_0201: as FB1 on sheet SOCPowerDecoupling; Datasheet Link: https://psearch.en.murata.com/inductor/product/LQP03HQ56NH02%23.html; Height: 0.42mm; Mouser Part Number: 81-LQP03HQ56NH02D; Mouser Price/Stock: https://www.mouser.co.uk/ProductDetail/Murata-Electronics/LQP03HQ56NH02D?qs=B6kkDfuK7%2FBQu1Ob9%2FT2Bg%3D%3D
IC2 = XC7Z030-2FFG676I: as IC2 on sheet SOCPowerDecoupling; Datasheet Link: http://www.xilinx.com/support/documentation/data_sheets/ds190-Zynq-7000-Overview.pdf; Height: 3.24mm; Manufacturer_Part_Number: XC7Z030-2FFG676I; Mouser Part Number: 217-XC7Z030-2FFG676I; Mouser Price/Stock: https://www.mouser.co.uk/ProductDetail/Xilinx/XC7Z030-2FFG676I?qs=rrS6PyfT74cuZK5O3CSpmw%3D%3D
IC3 = MT25QL128ABA8E12-0SIT: Micron 128 Mb QSPI NOR-Flash; Datasheet Link: https://media-www.micron.com/-/media/client/global/documents/products/data-sheet/nor-flash/serial-nor/mt25q/die-rev-a/mt25q_qlhs_l_128_aba_0.pdf?rev=8abb836059694966b54cf068a1803757; Height: 1.2mm; Manufacturer_Name: Micron; Manufacturer_Part_Number: MT25QL128ABA8E12-0SIT; Mouser Part Number: 340-283174-TRAY; Mouser Price/Stock: https://www.mouser.co.uk/ProductDetail/Micron/MT25QL128ABA8E12-0SIT?qs=rrS6PyfT74dfqAxiSUhsIQ%3D%3D; Arrow Part Number: MT25QL128ABA8E12-0SIT; Arrow Price/Stock: https://www.arrow.com/en/products/mt25ql128aba8e12-0sit/micron-technology?region=nac
IC4 = SN74LVC1G07DBVT: Integrated Circuit; Manufacturer_Name: Texas Instruments; Datasheet Link: http://www.ti.com/lit/gpn/sn74lvc1g07; Height: 1.45mm; Manufacturer_Part_Number: SN74LVC1G07DBVT; Mouser Part Number: 595-SN74LVC1G07DBVT; Mouser Price/Stock: https://www.mouser.co.uk/ProductDetail/Texas-Instruments/SN74LVC1G07DBVT?qs=pajgIaoyDUjU1UIYfW1NgQ%3D%3D; Arrow Part Number: SN74LVC1G07DBVT; Arrow Price/Stock: https://www.arrow.com/en/products/sn74lvc1g07dbvt/texas-instruments?region=nac
Q3 = T2N7002AK,LM: as Q1 on sheet SOCPowerSupplys; Datasheet Link: http://toshiba.semicon-storage.com/info/docget.jsp?did=29712&prodName=T2N7002AK; Height: 1.1mm; Manufacturer_Part_Number: T2N7002AK,LM; Mouser Part Number: 757-T2N7002AKLM; Mouser Price/Stock: https://www.mouser.co.uk/ProductDetail/Toshiba/T2N7002AKLM?qs=pzVvXTvk9PzfX4hYglwZ9Q%3D%3D; Arrow Part Number: T2N7002AK,LM; Arrow Price/Stock: https://www.arrow.com/en/products/t2n7002aklm/toshiba?region=nac
R39 R40 R42 R43 R45-R64 = RES_0201: Resistor SMD 0201; Manufacturer: *; Manufacturer Part Number: *; Distributor Link: *; LCSC: *
R41 = RES_0603: Resistor SMD 0603; Manufacturer: *; Manufacturer Part Number: *; Distributor Link: *; LCSC: *
R44 = RES_0402: Resistor SMD 0402; Manufacturer: *; Manufacturer Part Number: *; Distributor Link: *; LCSC: *
X2 = ECS-2520MV-130-BN-TR: as X1 on sheet PLBank33; Manufacturer Part Number: ECS-2520MV-130-BN-TR

## Sheet SOCDDR3Bank.SchDoc
size A3; SheetNumber: 15; SheetTotal: 18
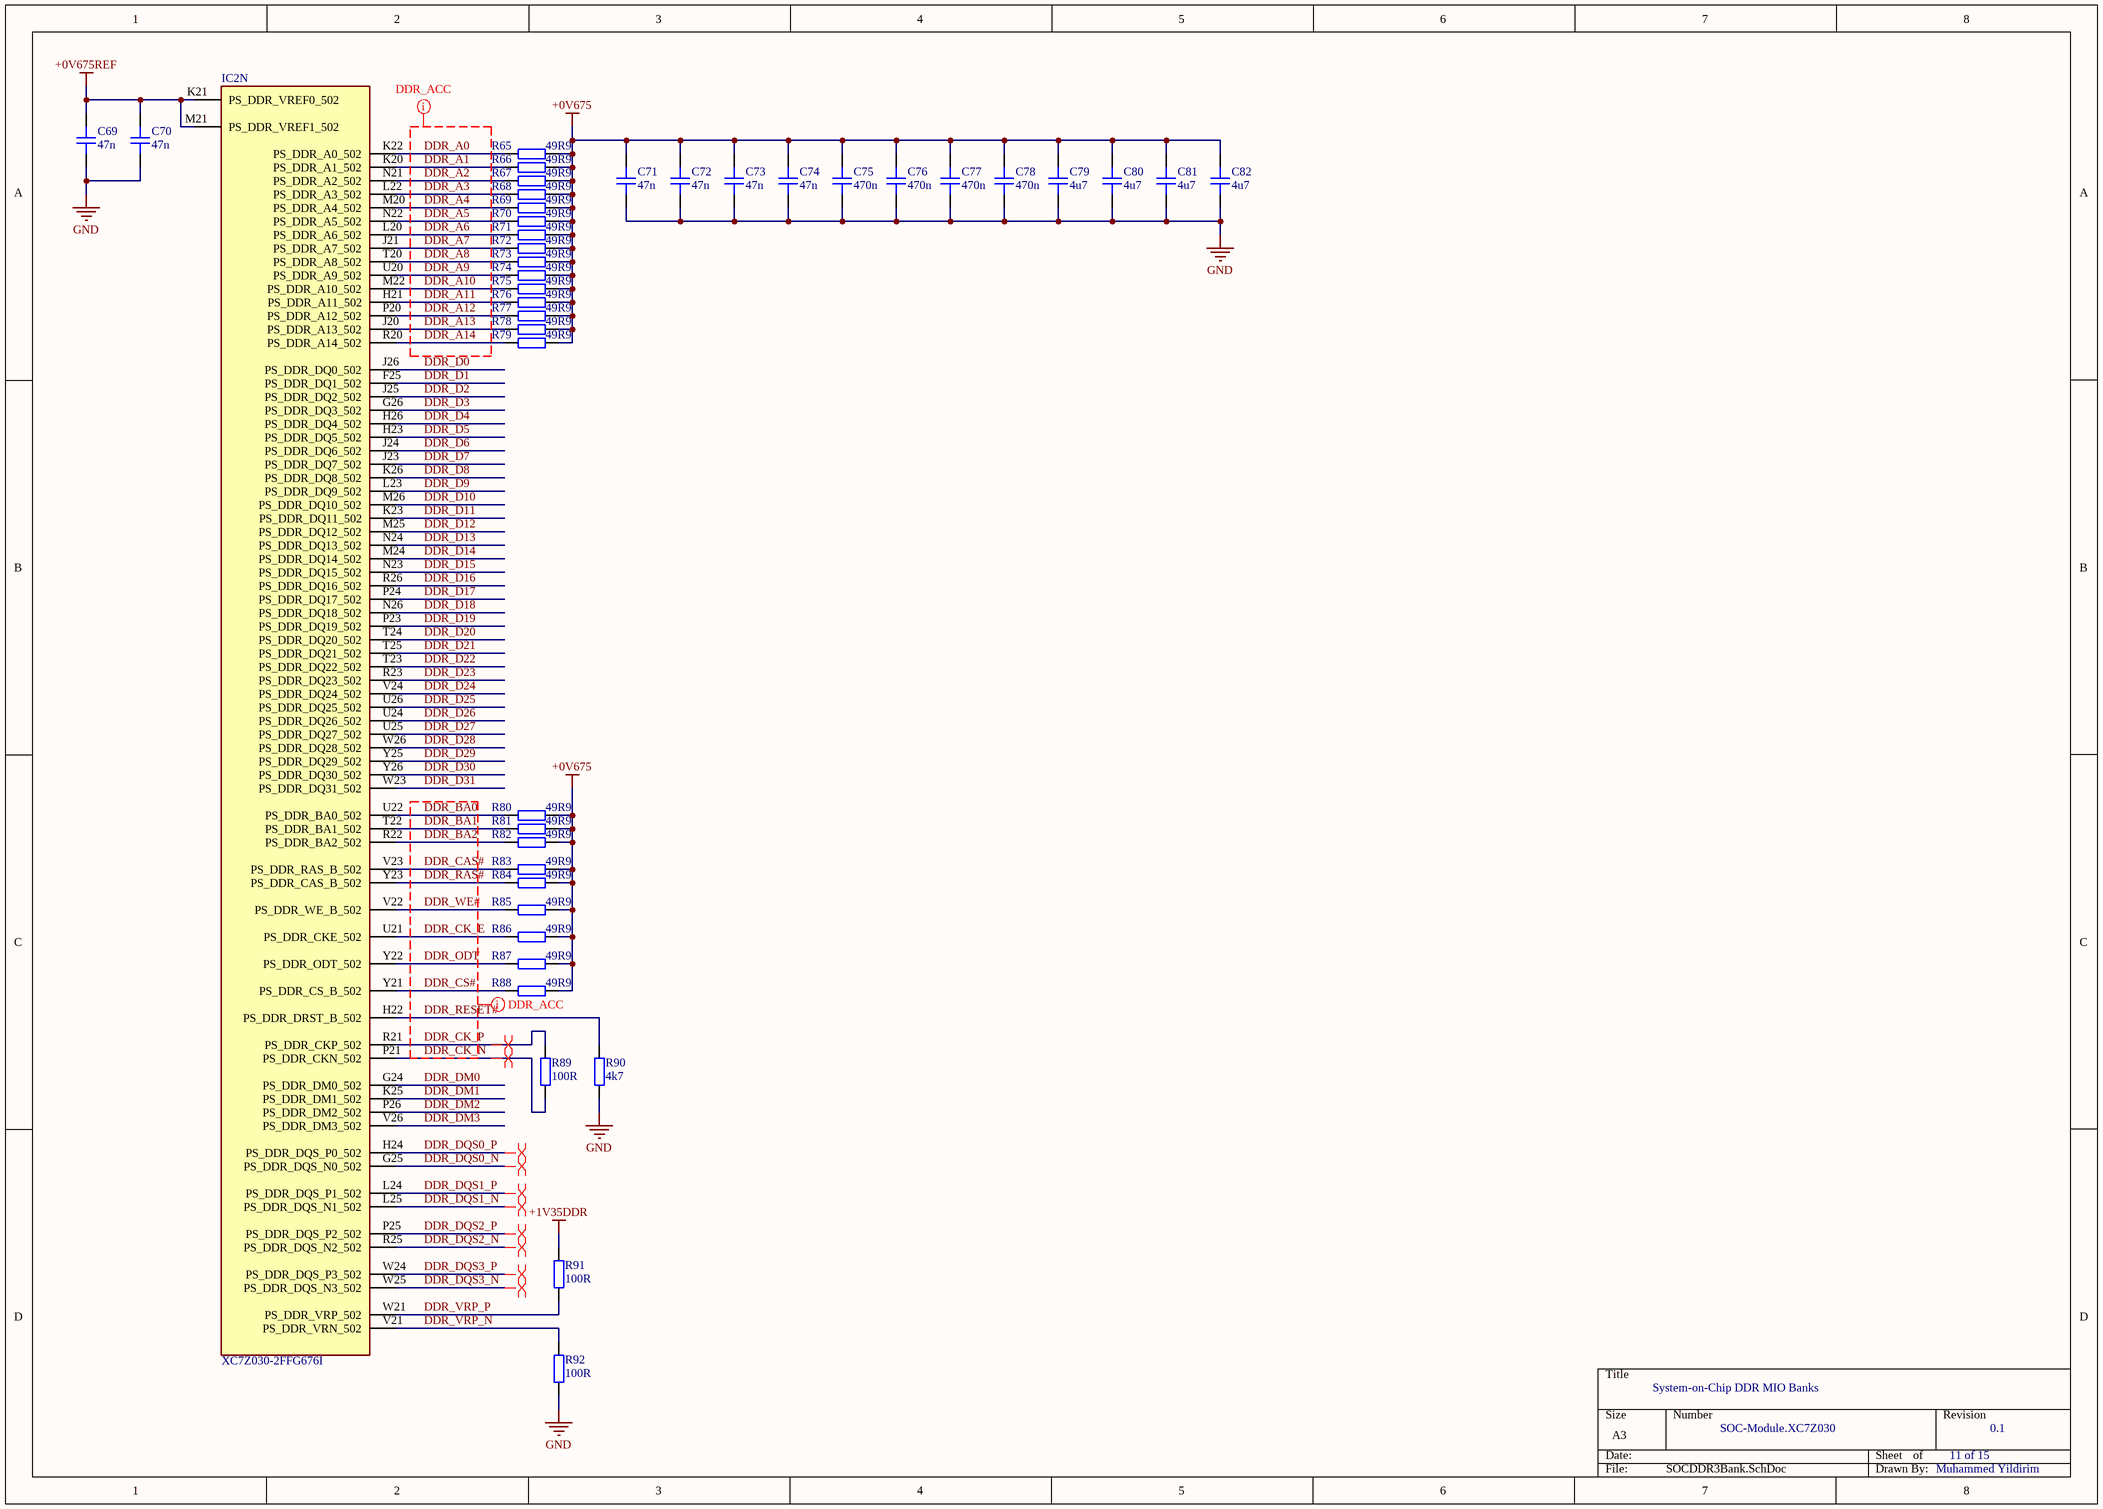
[diagram p14: SOCDDR3Bank.SchDoc]

### Parts
C69  47n  [CAP_0201]
C70  47n  [CAP_0201]
C71  47n  [CAP_0201]
C72  47n  [CAP_0201]
C73  47n  [CAP_0201]
C74  47n  [CAP_0201]
C75  470n  [CAP_0201]
C76  470n  [CAP_0201]
C77  470n  [CAP_0201]
C78  470n  [CAP_0201]
C79  4u7  [CAP_0402]
C80  4u7  [CAP_0402]
C81  4u7  [CAP_0402]
C82  4u7  [CAP_0402]
IC2  XC7Z030-2FFG676I  [BGA676C100P26X26_2700X2700X324]  (part N of 15)
R65  49R9  [RES_0201]
R66  49R9  [RES_0201]
R67  49R9  [RES_0201]
R68  49R9  [RES_0201]
R69  49R9  [RES_0201]
R70  49R9  [RES_0201]
R71  49R9  [RES_0201]
R72  49R9  [RES_0201]
R73  49R9  [RES_0201]
R74  49R9  [RES_0201]
R75  49R9  [RES_0201]
R76  49R9  [RES_0201]
R77  49R9  [RES_0201]
R78  49R9  [RES_0201]
R79  49R9  [RES_0201]
R80  49R9  [RES_0201]
R81  49R9  [RES_0201]
R82  49R9  [RES_0201]
R83  49R9  [RES_0201]
R84  49R9  [RES_0201]
R85  49R9  [RES_0201]
R86  49R9  [RES_0201]
R87  49R9  [RES_0201]
R88  49R9  [RES_0201]
R89  100R  [RES_0201]
R90  4k7  [RES_0201]
R91  100R  [RES_0201]
R92  100R  [RES_0201]

### Nets
+0V675: C71.2 C72.2 C73.2 C74.2 C75.2 C76.2 C77.2 C78.2 C79.2 C80.2 C81.2 C82.2 R65.1 R66.1 R67.1 R68.1 R69.1 R70.1 R71.1 R72.1 R73.1 R74.1 R75.1 R76.1 R77.1 R78.1 R79.1 R80.1 R81.1 R82.1 R83.1 R84.1 R85.1 R86.1 R87.1 R88.1
+0V675REF: C69.2 C70.2 IC2.K21(PS_DDR_VREF0_502) IC2.M21(PS_DDR_VREF1_502)
+1V35DDR: R91.2
GND: C69.1 C70.1 C71.1 C72.1 C73.1 C74.1 C75.1 C76.1 C77.1 C78.1 C79.1 C80.1 C81.1 C82.1 R90.1 R92.1
DDR_A0: IC2.K22(PS_DDR_A0_502) R65.2
DDR_A1: IC2.K20(PS_DDR_A1_502) R66.2
DDR_A2: IC2.N21(PS_DDR_A2_502) R67.2
DDR_A3: IC2.L22(PS_DDR_A3_502) R68.2
DDR_A4: IC2.M20(PS_DDR_A4_502) R69.2
DDR_A5: IC2.N22(PS_DDR_A5_502) R70.2
DDR_A6: IC2.L20(PS_DDR_A6_502) R71.2
DDR_A7: IC2.J21(PS_DDR_A7_502) R72.2
DDR_A8: IC2.T20(PS_DDR_A8_502) R73.2
DDR_A9: IC2.U20(PS_DDR_A9_502) R74.2
DDR_A10: IC2.M22(PS_DDR_A10_502) R75.2
DDR_A11: IC2.H21(PS_DDR_A11_502) R76.2
DDR_A12: IC2.P20(PS_DDR_A12_502) R77.2
DDR_A13: IC2.J20(PS_DDR_A13_502) R78.2
DDR_A14: IC2.R20(PS_DDR_A14_502) R79.2
DDR_BA0: IC2.U22(PS_DDR_BA0_502) R80.2
DDR_BA1: IC2.T22(PS_DDR_BA1_502) R81.2
DDR_BA2: IC2.R22(PS_DDR_BA2_502) R82.2
DDR_CAS#: IC2.V23(PS_DDR_RAS_B_502) R83.2
DDR_CK_E: IC2.U21(PS_DDR_CKE_502) R86.2
DDR_CK_N: IC2.P21(PS_DDR_CKN_502) R89.1
DDR_CK_P: IC2.R21(PS_DDR_CKP_502) R89.2
DDR_CS#: IC2.Y21(PS_DDR_CS_B_502) R88.2
DDR_D0: IC2.J26(PS_DDR_DQ0_502)
DDR_D1: IC2.F25(PS_DDR_DQ1_502)
DDR_D2: IC2.J25(PS_DDR_DQ2_502)
DDR_D3: IC2.G26(PS_DDR_DQ3_502)
DDR_D4: IC2.H26(PS_DDR_DQ4_502)
DDR_D5: IC2.H23(PS_DDR_DQ5_502)
DDR_D6: IC2.J24(PS_DDR_DQ6_502)
DDR_D7: IC2.J23(PS_DDR_DQ7_502)
DDR_D8: IC2.K26(PS_DDR_DQ8_502)
DDR_D9: IC2.L23(PS_DDR_DQ9_502)
DDR_D10: IC2.M26(PS_DDR_DQ10_502)
DDR_D11: IC2.K23(PS_DDR_DQ11_502)
DDR_D12: IC2.M25(PS_DDR_DQ12_502)
DDR_D13: IC2.N24(PS_DDR_DQ13_502)
DDR_D14: IC2.M24(PS_DDR_DQ14_502)
DDR_D15: IC2.N23(PS_DDR_DQ15_502)
DDR_D16: IC2.R26(PS_DDR_DQ16_502)
DDR_D17: IC2.P24(PS_DDR_DQ17_502)
DDR_D18: IC2.N26(PS_DDR_DQ18_502)
DDR_D19: IC2.P23(PS_DDR_DQ19_502)
DDR_D20: IC2.T24(PS_DDR_DQ20_502)
DDR_D21: IC2.T25(PS_DDR_DQ21_502)
DDR_D22: IC2.T23(PS_DDR_DQ22_502)
DDR_D23: IC2.R23(PS_DDR_DQ23_502)
DDR_D24: IC2.V24(PS_DDR_DQ24_502)
DDR_D25: IC2.U26(PS_DDR_DQ25_502)
DDR_D26: IC2.U24(PS_DDR_DQ26_502)
DDR_D27: IC2.U25(PS_DDR_DQ27_502)
DDR_D28: IC2.W26(PS_DDR_DQ28_502)
DDR_D29: IC2.Y25(PS_DDR_DQ29_502)
DDR_D30: IC2.Y26(PS_DDR_DQ30_502)
DDR_D31: IC2.W23(PS_DDR_DQ31_502)
DDR_DM0: IC2.G24(PS_DDR_DM0_502)
DDR_DM1: IC2.K25(PS_DDR_DM1_502)
DDR_DM2: IC2.P26(PS_DDR_DM2_502)
DDR_DM3: IC2.V26(PS_DDR_DM3_502)
DDR_DQS0_N: IC2.G25(PS_DDR_DQS_N0_502)
DDR_DQS0_P: IC2.H24(PS_DDR_DQS_P0_502)
DDR_DQS1_N: IC2.L25(PS_DDR_DQS_N1_502)
DDR_DQS1_P: IC2.L24(PS_DDR_DQS_P1_502)
DDR_DQS2_N: IC2.R25(PS_DDR_DQS_N2_502)
DDR_DQS2_P: IC2.P25(PS_DDR_DQS_P2_502)
DDR_DQS3_N: IC2.W25(PS_DDR_DQS_N3_502)
DDR_DQS3_P: IC2.W24(PS_DDR_DQS_P3_502)
DDR_ODT: IC2.Y22(PS_DDR_ODT_502) R87.2
DDR_RAS#: IC2.Y23(PS_DDR_CAS_B_502) R84.2
DDR_RESET#: IC2.H22(PS_DDR_DRST_B_502) R90.2
DDR_VRP_N: IC2.V21(PS_DDR_VRN_502) R92.2
DDR_VRP_P: IC2.W21(PS_DDR_VRP_502) R91.1
DDR_WE#: IC2.V22(PS_DDR_WE_B_502) R85.2

### Layout directives
differential pair: DDR_CK_N, DDR_CK_P, DDR_DQS0_N, DDR_DQS0_P, DDR_DQS1_N, DDR_DQS1_P, DDR_DQS2_N, DDR_DQS2_P, DDR_DQS3_N, DDR_DQS3_P
mark named DDR_ACC: DDR_A0, DDR_A1, DDR_A2, DDR_A3, DDR_A4, DDR_A5, DDR_A6, DDR_A7, DDR_A8, DDR_A9, DDR_A10, DDR_A11, DDR_A12, DDR_A13, DDR_A14, DDR_BA0, DDR_BA1, DDR_BA2, DDR_CAS#, DDR_CK_E, DDR_CK_N, DDR_CK_P, DDR_CS#, DDR_ODT, DDR_RAS#, DDR_RESET#, DDR_WE#

### Notes on the sheet
- System-on-Chip DDR MIO Banks
- SOC-Module.XC7Z030
- 11 of 15
- 0.1
- Muhammed Yildirim

### Library data of the parts
C69-C78 = CAP_0201: Capacitor SMD 0201; Manufacturer: *; Manufacturer Part Number: *; Distributor Link: *; LCSC: *; Rating: *; Dielectric: *
C79-C82 = CAP_0402: Capacitor SMD 0402; Manufacturer: *; Manufacturer Part Number: *; Distributor Link: *; LCSC: *; Rating: *; Dielectric: *
IC2 = XC7Z030-2FFG676I: as IC2 on sheet SOCPowerDecoupling; Datasheet Link: http://www.xilinx.com/support/documentation/data_sheets/ds190-Zynq-7000-Overview.pdf; Height: 3.24mm; Manufacturer_Part_Number: XC7Z030-2FFG676I; Mouser Part Number: 217-XC7Z030-2FFG676I; Mouser Price/Stock: https://www.mouser.co.uk/ProductDetail/Xilinx/XC7Z030-2FFG676I?qs=rrS6PyfT74cuZK5O3CSpmw%3D%3D
R65-R92 = RES_0201: Resistor SMD 0201; Manufacturer: *; Manufacturer Part Number: *; Distributor Link: *; LCSC: *